# EasyEDA Pro project timer.eprj

# Schematic Schematic1

## Sheets
1 控制部分: Board Name: Board1; Create Date: 2025-01-11; Page Name: 控制部分; Project Name: timer; Schematic Name: Schematic1; Update Date: 2025-02-27; Company: 嘉立创EDA; Page Size: A4; Version: V1.0
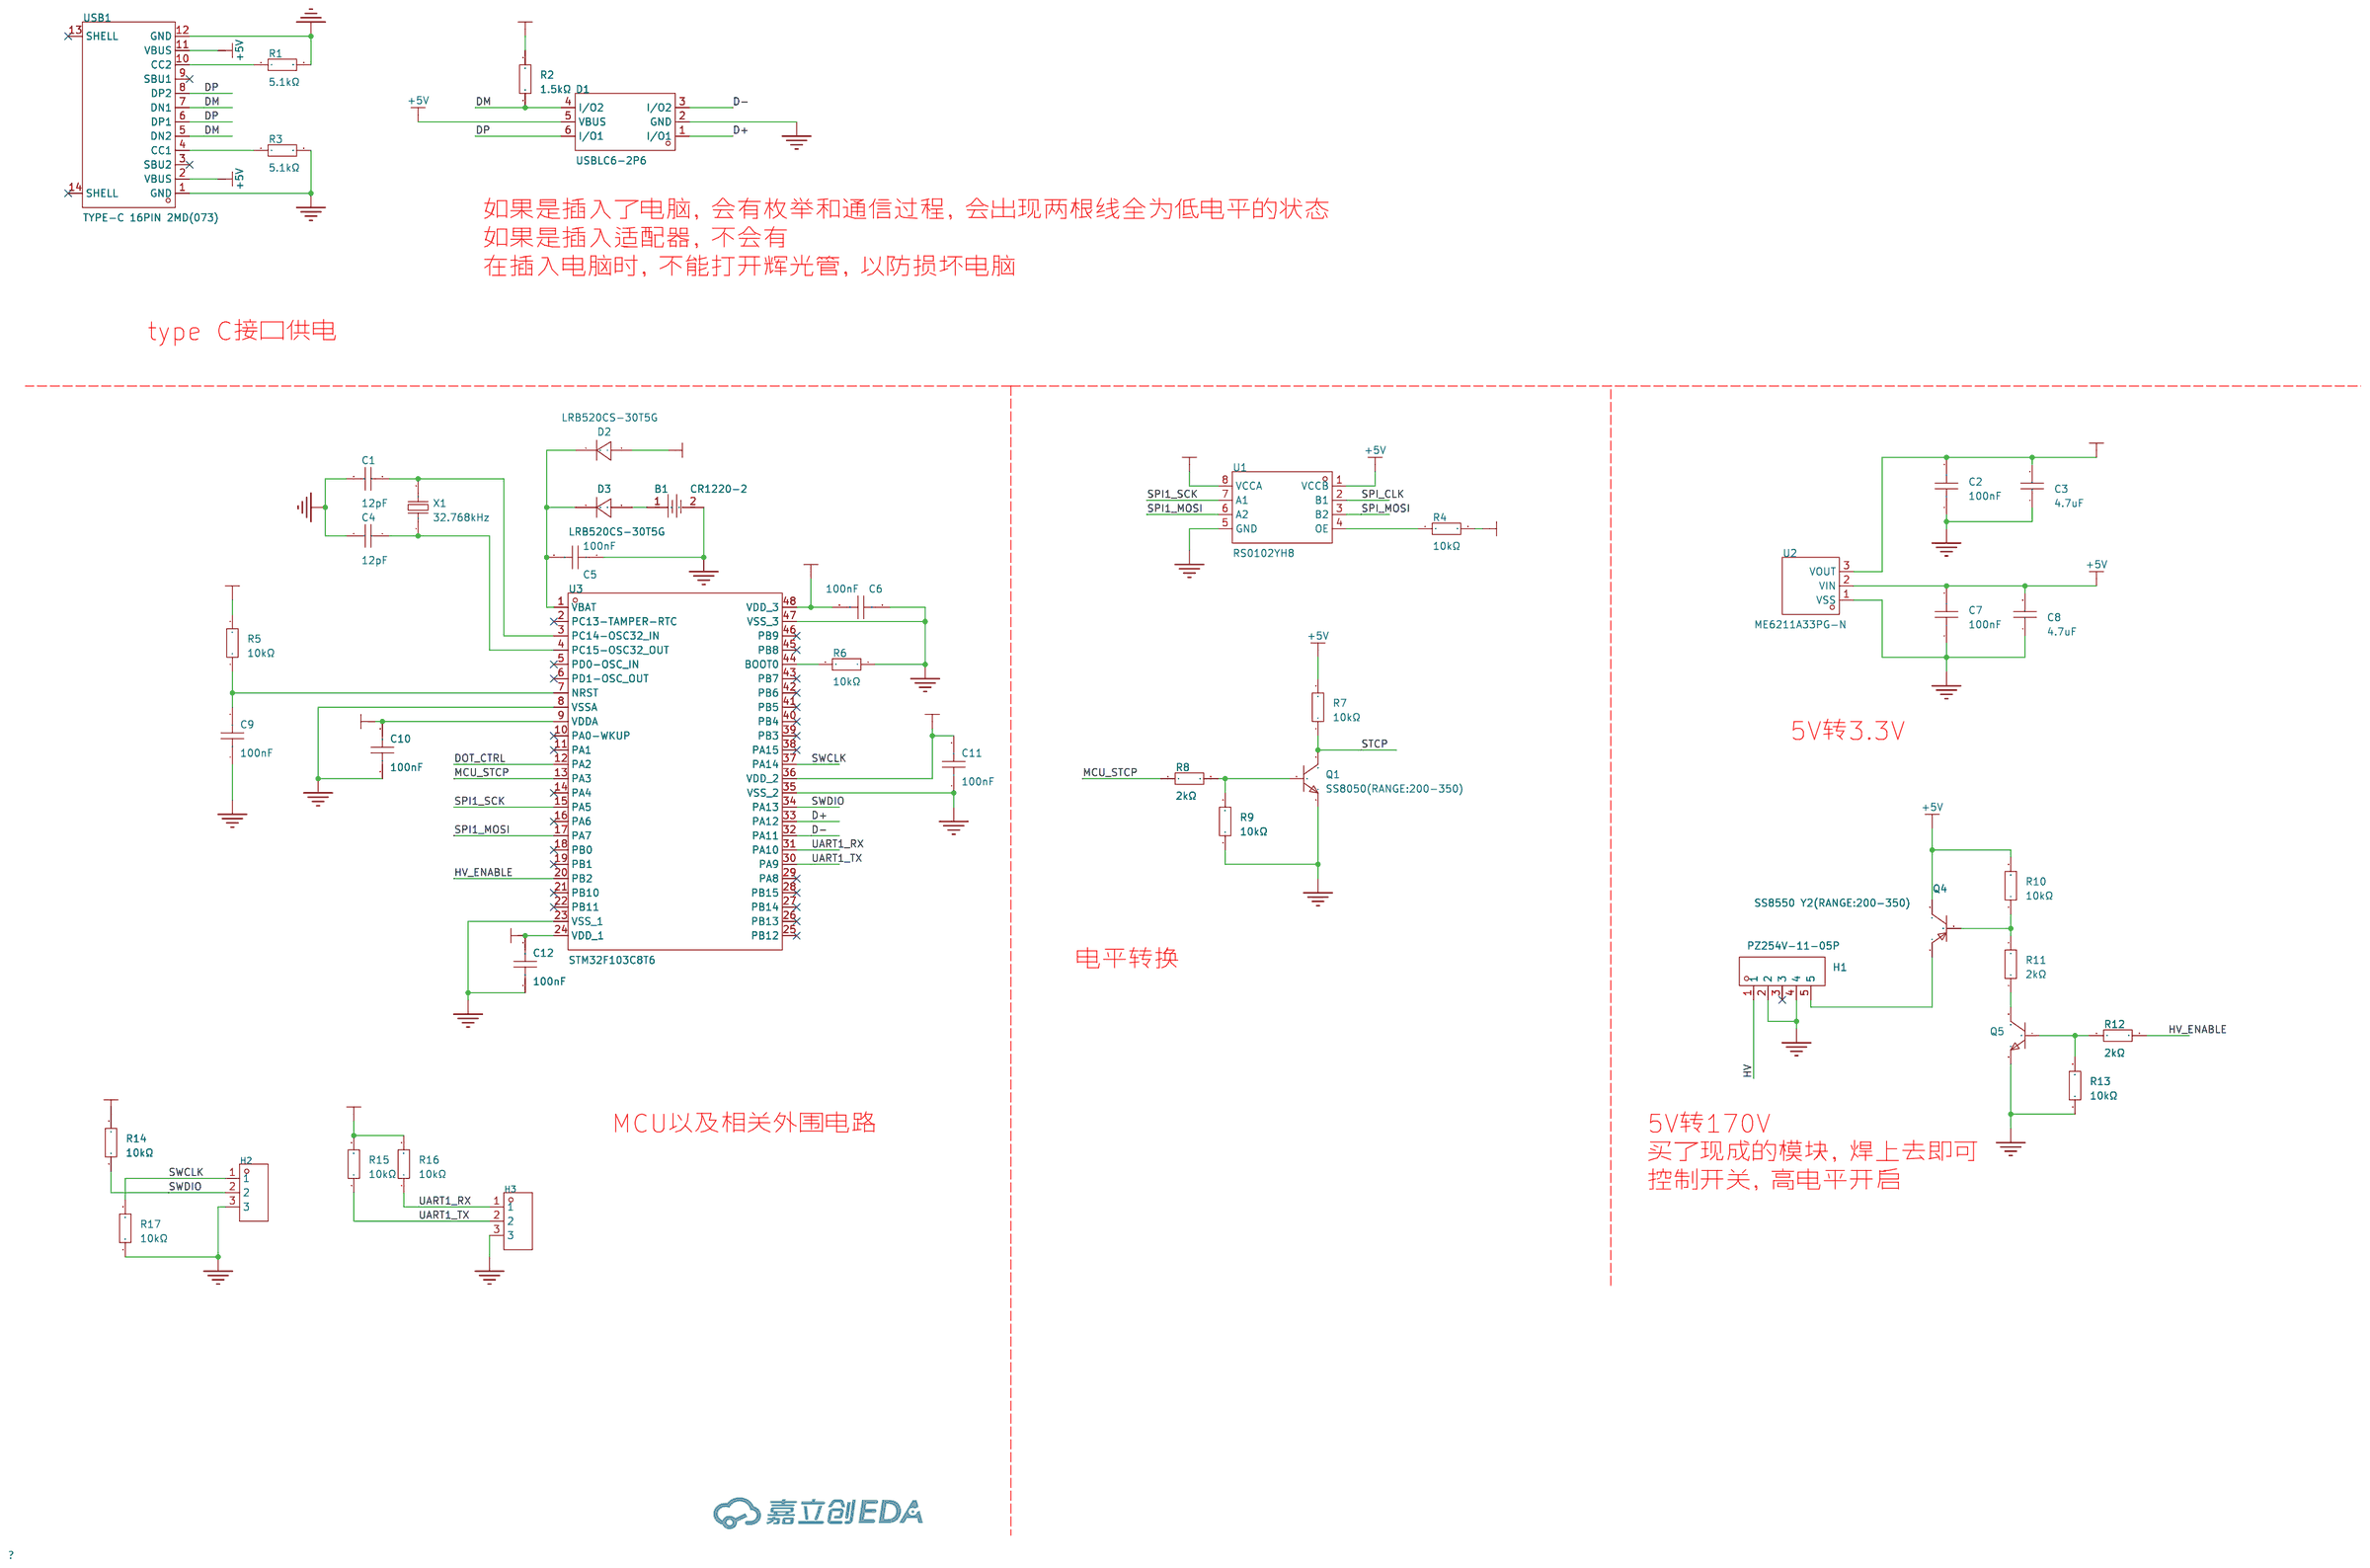
[diagram p0: 控制部分]
2 显示部分: Page Name: 显示部分; Update Date: 2025-01-16
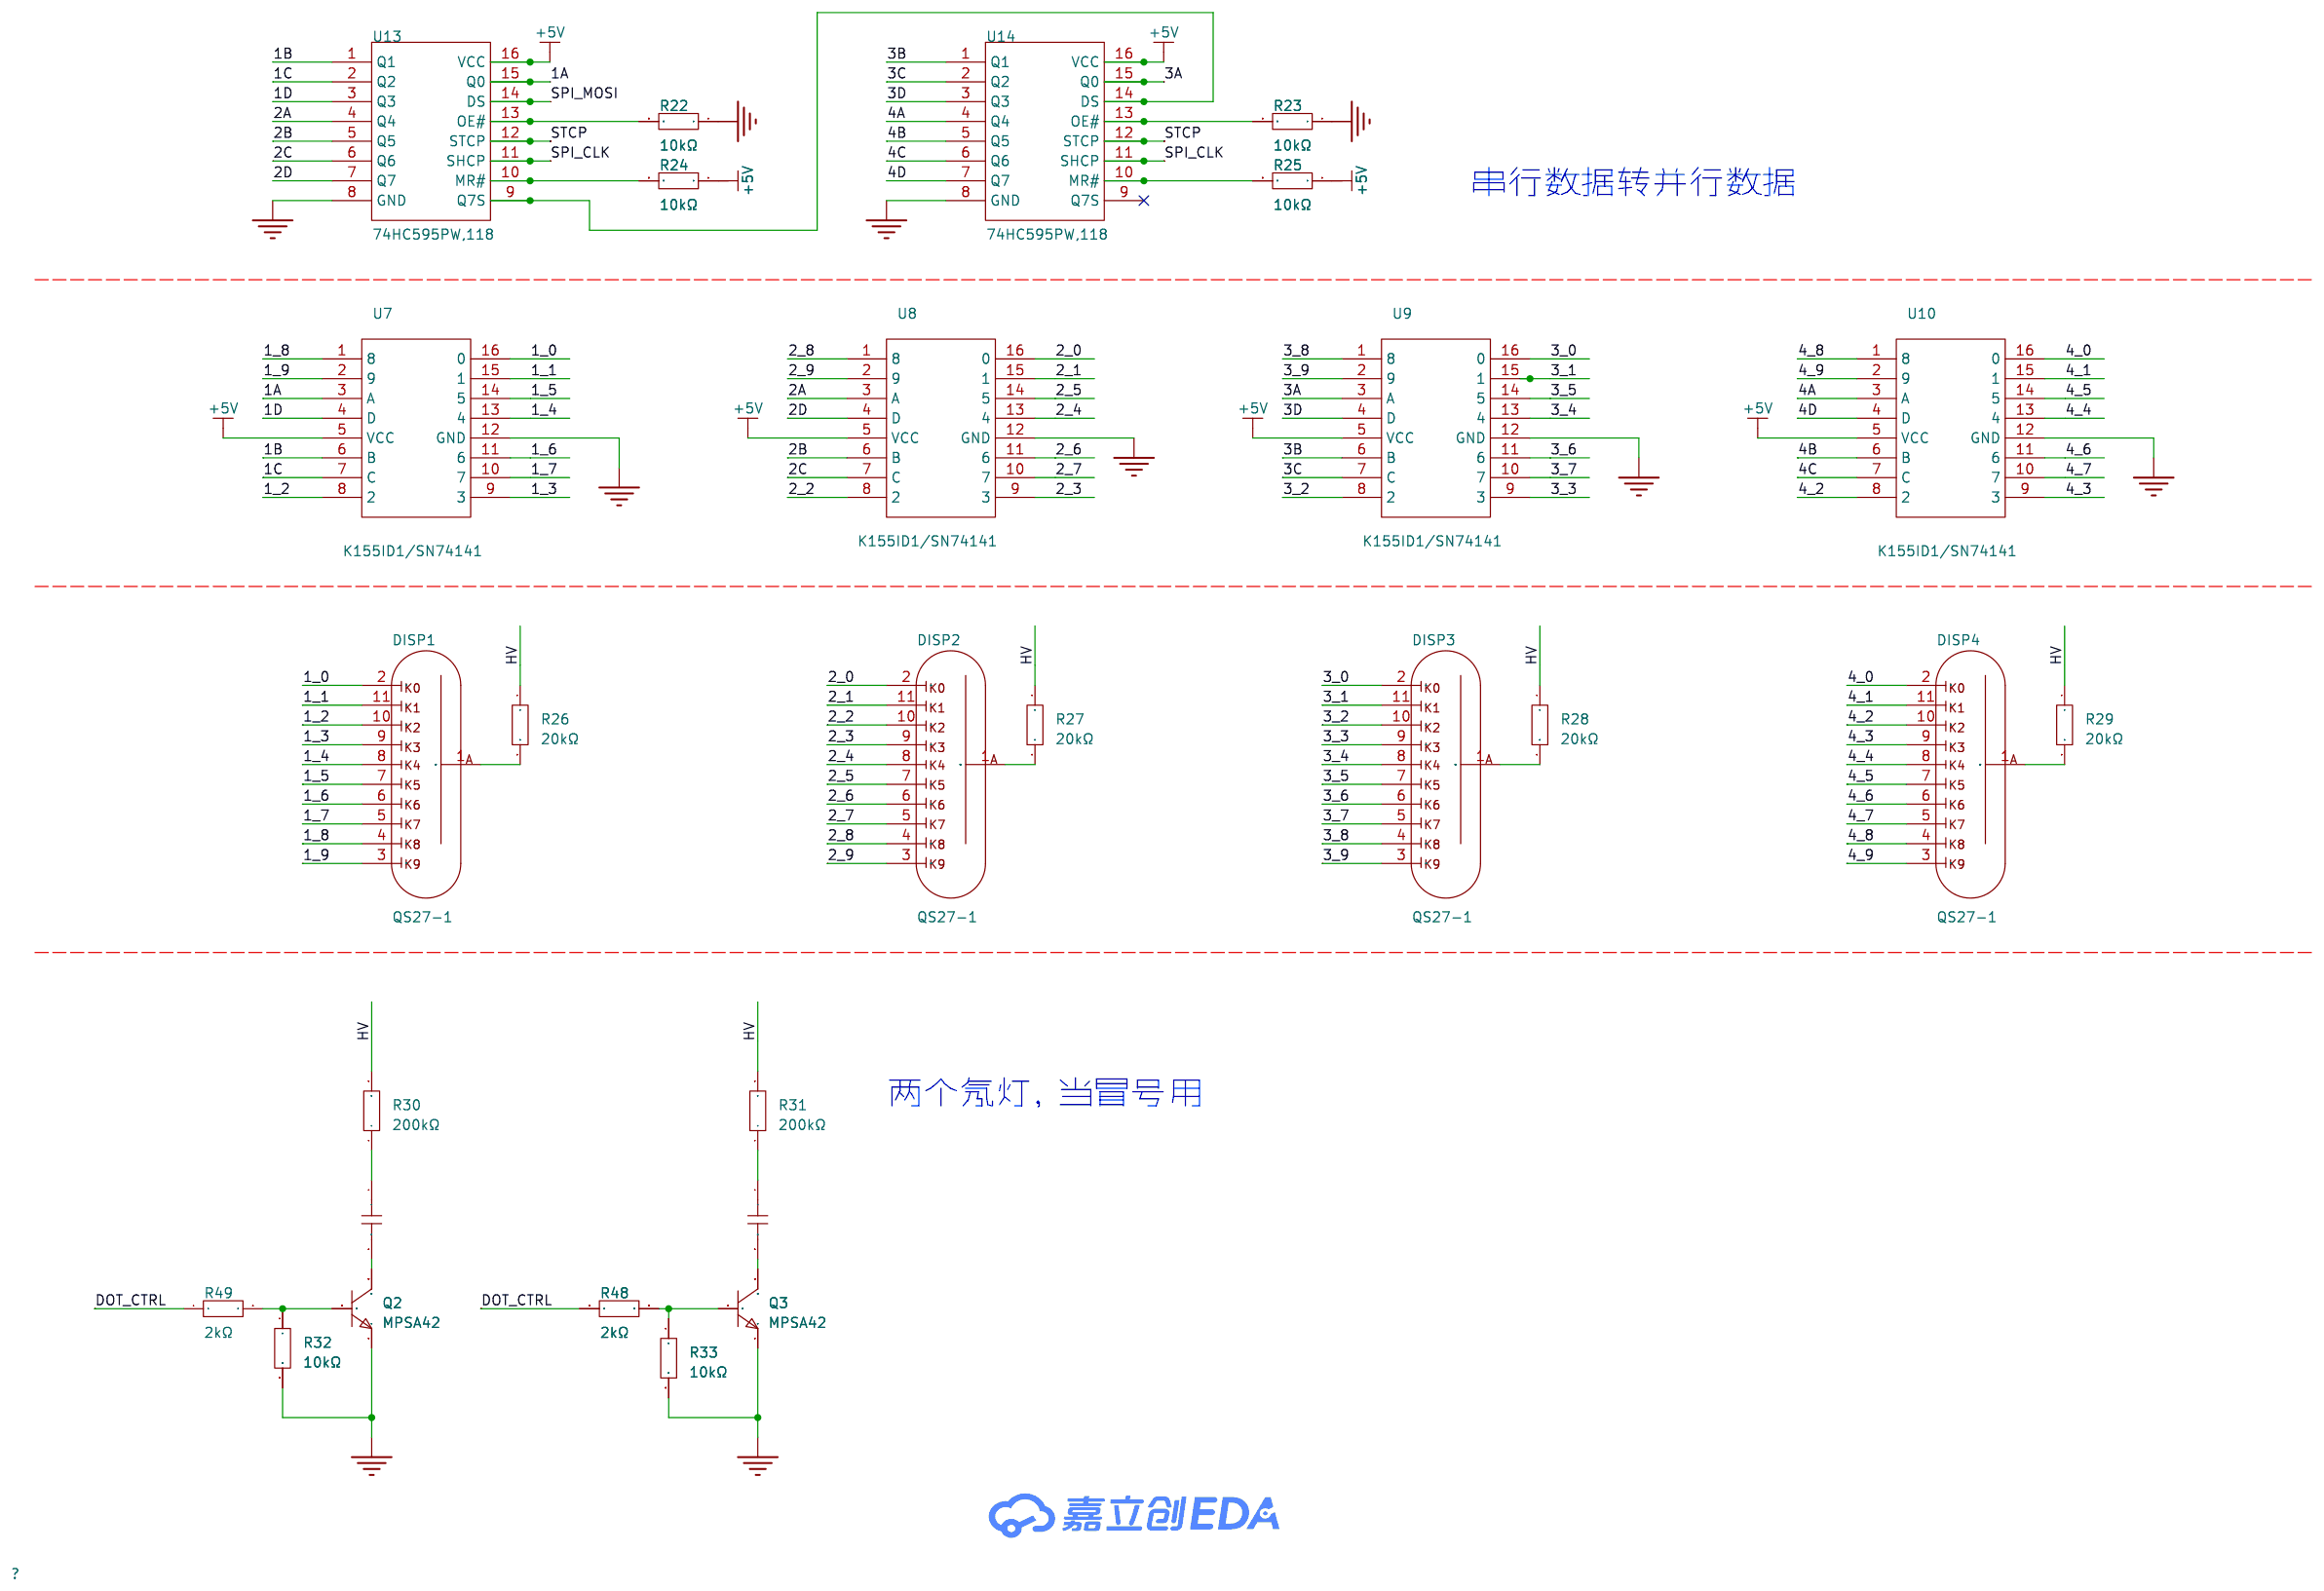
[diagram p1: 显示部分]

## Parts
sheet 控制部分
B1  CR1220-2  [BAT-SMD_CR1220-2]
C1  12pF  [C0603]
C2  100nF  [C0603]
C3  4.7uF  [C0603]
C4  12pF  [C0603]
C5  100nF  [C0603]
C6  100nF  [C0603]
C7  100nF  [C0603]
C8  4.7uF  [C0603]
C9  100nF  [C0603]
C10  100nF  [C0603]
C11  100nF  [C0603]
C12  100nF  [C0603]
D1  USBLC6-2P6  [SOT-666-6_L1.6-W1.2-P0.50-LS1.6-BL]
D2  LRB520CS-30T5G  [SOD-923_L0.8-W0.6-LS1.0-RD]
D3  LRB520CS-30T5G  [SOD-923_L0.8-W0.6-LS1.0-RD]
H1  PZ254V-11-05P  [HDR-TH_5P-P2.54-V-M]
H2  PZ254V-11-03P  [HDR-TH_3P-P2.54-V-M]
H3  PZ254V-11-03P  [HDR-TH_3P-P2.54-V-M]
Q1  SS8050(RANGE:200-350)  [SOT-23-3_L2.9-W1.3-P1.90-LS2.4-BR]
Q4  SS8550 Y2(RANGE:200-350)  [SOT-23-3_L2.9-W1.3-P1.90-LS2.4-BR]
Q5  SS8050(RANGE:200-350)  [SOT-23-3_L2.9-W1.3-P1.90-LS2.4-BR]
R1  5.1kΩ  [R0603]
R2  1.5kΩ  [R0603]
R3  5.1kΩ  [R0603]
R4  10kΩ  [R0603]
R5  10kΩ  [R0603]
R6  10kΩ  [R0603]
R7  10kΩ  [R0603]
R8  2kΩ  [R0603]
R9  10kΩ  [R0603]
R10  10kΩ  [R0603]
R11  2kΩ  [R0603]
R12  2kΩ  [R0603]
R13  10kΩ  [R0603]
R14  10kΩ  [R0603]
R15  10kΩ  [R0603]
R16  10kΩ  [R0603]
R17  10kΩ  [R0603]
U1  RS0102YH8  [SOT-23-8_L3.0-W1.7-P0.65-LS2.8-BL]
U2  ME6211A33PG-N  [SOT-89_L4.5-W2.5-P1.50-LS4.2-BR]
U3  STM32F103C8T6  [LQFP-48_L7.0-W7.0-P0.50-LS9.0-BL]
USB1  TYPE-C 16PIN 2MD(073)  [USB-C-SMD_TYPE-C-6PIN-2MD-073]
X1  32.768kHz  [FC-135R_L3.2-W1.5]
sheet 显示部分
DISP1  QS27-1  [QS27-1]
DISP2  QS27-1  [QS27-1]
DISP3  QS27-1  [QS27-1]
DISP4  QS27-1  [QS27-1]
NE1  NE  [NE]
NE2  NE  [NE]
Q2  MPSA42  [TO-92-3_L4.9-W3.7-P1.27-L]
Q3  MPSA42  [TO-92-3_L4.9-W3.7-P1.27-L]
R22  10kΩ  [R0603]
R23  10kΩ  [R0603]
R24  10kΩ  [R0603]
R25  10kΩ  [R0603]
R26  20kΩ  [R1206]
R27  20kΩ  [R1206]
R28  20kΩ  [R1206]
R29  20kΩ  [R1206]
R30  200kΩ  [R1206]
R31  200kΩ  [R1206]
R32  10kΩ  [R0603]
R33  10kΩ  [R0603]
R48  2kΩ  [R0603]
R49  2kΩ  [R0603]
U7  K155ID1/SN74141  [DIP16]
U8  K155ID1/SN74141  [DIP16]
U9  K155ID1/SN74141  [DIP16]
U10  K155ID1/SN74141  [DIP16]
U13  74HC595PW,118  [TSSOP-16_L5.0-W4.4-P0.65-LS6.4-BL]
U14  74HC595PW,118  [TSSOP-16_L5.0-W4.4-P0.65-LS6.4-BL]

## Library data of the parts
B1 = CR1220-2: LCSC Part Name: 电池底座 适用电池:CR1220; Supplier Part: C70381; Manufacturer: Q&J; Supplier Footprint: SMD; JLCPCB Part Class: 扩展库; Datasheet: https://atta.szlcsc.com/upload/public/pdf/source/20160427/1461725216696.pdf; Supplier: LCSC; Connector Type: 电池底座; Battery Type: CR1220
C1 C4 = CC0603JRNPO9BN120: LCSC Part Name: 12pF ±5% 50V; Supplier Part: C107034; Manufacturer: YAGEO(国巨); Supplier Footprint: 0603; JLCPCB Part Class: 扩展库; Datasheet: https://atta.szlcsc.com/upload/public/pdf/source/20170914/C128857_1505359892143968080.pdf; Supplier: LCSC; Tolerance: ±5%; Voltage Rated: 50V; Temperature Coefficient: NP0
C2 C5-C7 C9-C12 = CC0603KRX7R9BB104: LCSC Part Name: 100nF ±10% 50V; Supplier Part: C14663; Manufacturer: YAGEO(国巨); Supplier Footprint: 0603; JLCPCB Part Class: 基础库; Datasheet: https://atta.szlcsc.com/upload/public/pdf/source/20180910/C282072_33301C7F631E79921B82A8DAC6BCC5B3.pdf; Supplier: LCSC; Tolerance: ±10%; Voltage Rated: 50V; Temperature Coefficient: X7R
C3 C8 = CL10A475KO8NNNC: LCSC Part Name: 4.7uF ±10% 16V; Supplier Part: C19666; Manufacturer: SAMSUNG(三星); Supplier Footprint: 0603; JLCPCB Part Class: 基础库; Datasheet: https://atta.szlcsc.com/upload/public/pdf/source/20160218/1457707763339.pdf; Supplier: LCSC; Tolerance: ±10%; Voltage Rated: 16V; Temperature Coefficient: X5R
D1 = USBLC6-2P6_C2827693: LCSC Part Name: MSL=3; Supplier Part: C2827693; Manufacturer: TECH PUBLIC(台舟); Supplier Footprint: SOT-666-6; JLCPCB Part Class: 扩展库; Datasheet: https://atta.szlcsc.com/upload/public/pdf/source/20210810/36353A9194EA9F4E33F8AE18BE051AEA.pdf; Supplier: LCSC; polarity: 单向; Reverse Stand-Off Voltage (Vrwm): 5V; Maximum Clamping Voltage: 14V; Peak Pulse Current (Ipp): 5.5A; Peak Pulse Power Dissipation (Ppp): 80W; Breakdown Voltage: 6V; Reverse Leakage Current (Ir): 80nA; Number of Lines: 双路; Operating Temperature: -55℃~+125℃; level of protection: IEC 61000-4-2; Type: ESD
D2 D3 = LRB520CS-30T5G: LCSC Part Name: 电压:30V 电流:100mA; Supplier Part: C131732; Manufacturer: LRC(乐山无线电); Supplier Footprint: SOD-923; JLCPCB Part Class: 扩展库; Datasheet: https://atta.szlcsc.com/upload/public/pdf/source/20180130/C131732_15172972951101323323.pdf; Supplier: LCSC; Forward Voltage (Vf@If): 450mV; Reverse Voltage (Vr): 30V; Rectified Current: 100mA; Reverse Leakage Current (Ir): 500nA
H1 = PZ254V-11-05P: LCSC Part Name: 间距:2.54mm 1x5P 直插 方针; Supplier Part: C492404; Manufacturer: XFCN(兴飞); Supplier Footprint: 插件,P=2.54mm; JLCPCB Part Class: 扩展库; Datasheet: https://atta.szlcsc.com/upload/public/pdf/source/20200309/C492404_E51533260F8710EFF5D4617281164C1D.pdf; Supplier: LCSC; Pin Structure: 1x5P; Pitch: 2.54mm; Circluar Pins/Square Pins: 方针; Mounting Type: 直插; Number of Rows: 单排; Number of Pins: 5P; Length of Mating Pin: 6mm; Insulation Height: 2.5mm; Length of End Connection Pin: 3mm; Contact Material: 黄铜; Operating Temperature Range: -40℃~+105℃; Color: 黑色
H2 H3 = PZ254V-11-03P: 插针结构:1x3P;间距:2.54mm;行距:-;圆针/方针:方针;安装类型:直插;排数:单排;总PIN位数:3P;额定电流:3A;额定电压:250V;配合针长度:6mm;塑高:2.5mm;端接针长度:3mm;工作温度范围:-40℃~+105℃;颜色:黑色;; LCSC Part Name: 间距:2.54mm 1x3P 直插 方针; Supplier Part: C2937625; Manufacturer: XFCN(兴飞); Supplier Footprint: 插件,P=2.54mm; JLCPCB Part Class: 扩展库; Datasheet: https://atta.szlcsc.com/upload/public/pdf/source/20200309/C492402_8335C3D49C4E4C618838D59BB1D024C1.pdf; Supplier: LCSC; Pin Structure: 1x3P; Pitch: 2.54mm; Circluar Pins/Square Pins: 方针; Mounting Type: 直插; Number of Rows: 单排; Number of Pins: 3P; Current Rating (Max): 3A; Voltage Rating (Max): 250V; Length of Mating Pin: 6mm; Insulation Height: 2.5mm; Length of End Connection Pin: 3mm; Operating Temperature Range: -40℃~+105℃; Color: 黑色
Q1 Q5 = SS8050(RANGE:200-350)_C2150: LCSC Part Name: NPN 电流:1.5A 耐压:25V hfe=200~350; Supplier Part: C2150; Manufacturer: CJ(江苏长电/长晶); Supplier Footprint: SOT-23; JLCPCB Part Class: 基础库; Datasheet: https://atta.szlcsc.com/upload/public/pdf/source/20230322/AEE86F4B043774EFF80CAEA14A37D9E9.pdf; Supplier: LCSC; Transistor Type: NPN; Collector Current (Ic): 1.5A; Collector-Emitter Breakdown Voltage (Vceo): 25V; Power Dissipation (Pd): 300mW; DC Current Gain (hFE@Ic,Vce): 200@800mA,1V; Transition Frequency (fT): 100MHz; Collector Cut-Off Current (Icbo): 100nA; Collector-Emitter Saturation Voltage (VCE(sat)@Ic,Ib): 500mV@800mA,80mA; Operating Temperature: -55℃~+150℃
Q4 = SS8550 Y2(RANGE:200-350): LCSC Part Name: PNP 电流:1.5A 耐压:25V hfe=200~350; Supplier Part: C8542; Manufacturer: CJ(江苏长电/长晶); Supplier Footprint: SOT-23; JLCPCB Part Class: 基础库; Datasheet: https://atta.szlcsc.com/upload/public/pdf/source/20140809/1457707214734.pdf; Supplier: LCSC; Transistor Type: PNP; Collector Current (Ic): 1.5A; Collector-Emitter Breakdown Voltage (Vceo): 25V; Power Dissipation (Pd): 300mW; DC Current Gain (hFE@Ic,Vce): 200@100mA,1V; Transition Frequency (fT): 100MHz; Collector Cut-Off Current (Icbo): 100nA; Collector-Emitter Saturation Voltage (VCE(sat)@Ic,Ib): 500mV@800mA,80mA; Operating Temperature: -55℃~+150℃
R1 R3 = 0603WAF5101T5E: LCSC Part Name: 5.1kΩ ±1% 100mW 厚膜电阻; Supplier Part: C23186; Manufacturer: UNI-ROYAL(厚声); Supplier Footprint: 0603; JLCPCB Part Class: 基础库; Datasheet: https://atta.szlcsc.com/upload/public/pdf/source/20200306/C422600_1E6D84923E4A46A82E41ADD87F860B5C.pdf; Supplier: LCSC; Type: 厚膜电阻; Tolerance: ±1%; Power(Watts): 100mW; Overload Voltage (Max): 75V; Temperature Coefficient: ±100ppm/℃; Operating Temperature Range: -55℃~+155℃
R2 = 0603WAF1501T5E: LCSC Part Name: 1.5kΩ ±1% 100mW 厚膜电阻; Supplier Part: C22843; Manufacturer: UNI-ROYAL(厚声); Supplier Footprint: 0603; JLCPCB Part Class: 基础库; Datasheet: https://atta.szlcsc.com/upload/public/pdf/source/20200306/C422600_1E6D84923E4A46A82E41ADD87F860B5C.pdf; Supplier: LCSC; Type: 厚膜电阻; Tolerance: ±1%; Power(Watts): 100mW; Overload Voltage (Max): 75V; Temperature Coefficient: ±100ppm/℃; Operating Temperature Range: -55℃~+155℃
R4-R7 R9 R10 R13-R17 R22-R25 R32 R33 = 0603WAF1002T5E: LCSC Part Name: 厚膜电阻 10kΩ ±1% 100mW; Supplier Part: C25804; Manufacturer: UNI-ROYAL(厚声); Supplier Footprint: 0603; JLCPCB Part Class: 基础库; Datasheet: https://atta.szlcsc.com/upload/public/pdf/source/20200306/C422600_1E6D84923E4A46A82E41ADD87F860B5C.pdf; Supplier: LCSC; Type: 厚膜电阻; Tolerance: ±1%; Power(Watts): 100mW; Overload Voltage (Max): 75V; Temperature Coefficient: ±100ppm/℃; Operating Temperature Range: -55℃~+155℃
R8 R11 R12 R48 R49 = 0603WAF2001T5E: LCSC Part Name: 2kΩ ±1% 100mW 厚膜电阻; Supplier Part: C22975; Manufacturer: UNI-ROYAL(厚声); Supplier Footprint: 0603; JLCPCB Part Class: 基础库; Datasheet: https://atta.szlcsc.com/upload/public/pdf/source/20200306/C422600_1E6D84923E4A46A82E41ADD87F860B5C.pdf; Supplier: LCSC; Type: 厚膜电阻; Tolerance: ±1%; Power(Watts): 100mW; Overload Voltage (Max): 75V; Temperature Coefficient: ±100ppm/℃; Operating Temperature Range: -55℃~+155℃
U1 = RS0102YH8: LCSC Part Name: 电平转换芯片; Supplier Part: C783414; Manufacturer: RUNIC(润石); Supplier Footprint: SOT-23-8; JLCPCB Part Class: 扩展库; Datasheet: https://atta.szlcsc.com/upload/public/pdf/source/20200914/C783414_6557205211B20B027C7967DA27FC02D7.pdf; Supplier: LCSC; Channel Type: 双向; Data Rate: 24Mbps; Supply Voltage (VCCA): 1.65V~5.5V; Supply Voltage (VCCB): 2.3V~5.5V; Number of Circuits: 1; Channels per Circuit: 2; Output Type: 推挽式；开路漏极; Operating Temperature: -40℃~+85℃
U2 = ME6211A33PG-N: LCSC Part Name: 输入6V 输出3.3V 500mA; Supplier Part: C236673; Manufacturer: MICRONE(南京微盟); Supplier Footprint: SOT-89; JLCPCB Part Class: 扩展库; Datasheet: https://atta.szlcsc.com/upload/public/pdf/source/20180801/C94042_8FDAFF138ADDED65E3D077205E9A8C17.pdf; Supplier: LCSC; Output Type: 固定; Maximum Input Voltage: 6V; Output Voltage: 3.3V; MAX Output Current: 500mA; Power Supply Rejection Ratio (PSRR): 70dB; Dropout Voltage: 260mV@(200mA); Output Polarity: 正极; Number of Outputs: 1
U3 = STM32F103C8T6: LCSC Part Name: 主流增强型ARM Cortex-M3 MCU，具有64 KB Flash、72 MHz CPU、电机控制、USB和CAN; Supplier Part: C8734; Manufacturer: ST(意法半导体); Supplier Footprint: LQFP-48(7x7); JLCPCB Part Class: 扩展库; Datasheet: https://atta.szlcsc.com/upload/public/pdf/source/20220812/8363ACEC51AD55ECEB84799464F7CB85.pdf; Supplier: LCSC; CPU Core: ARM-M3; CPU Maximum Speed: 72MHz; Program Storage Size: 64KB; Program Memory Type: FLASH; Number of I/O: 37; ADC (Bit): 12bit; Low Voltage Detection Threshold: 2V~3.6V
USB1 = TYPE-C 16PIN 2MD(073): LCSC Part Name: Type-C 母 卧贴; Supplier Part: C2765186; Manufacturer: SHOU HAN(首韩); Supplier Footprint: SMD; JLCPCB Part Class: 扩展库; Datasheet: https://atta.szlcsc.com/upload/public/pdf/source/20211123/39B17C16241EAC15C5E277BDA434118E.pdf; Supplier: LCSC; Connector Type: Type-C; Standard: USB 3.1; Gender: 母; Mounting Style: 卧贴; Number of Contacts: 16P; Number of Ports: 1; Current Rating - Power (Max): 5A; Operating Temperature Range: -25℃~+85℃; Rated Voltage (Max): 5V; Connect-Disconnect Life: 5千次; Core Colour: 黑色
X1 = Q13FC13500004_C32346: LCSC Part Name: 32.768kHz ±20ppm 12.5pF; Supplier Part: C32346; Manufacturer: EPSON(爱普生); Manufacturer Part: Q13FC13500004; Supplier Footprint: SMD3215-2P; JLCPCB Part Class: 基础库; Datasheet: https://atta.szlcsc.com/upload/public/pdf/source/20240418/0E0FF5F0356BA3753F616001439D1416.pdf; Supplier: LCSC; Crystal Type: 贴片晶振; Normal temperature Frequency Tolerance: ±20ppm; Load Capacitor: 12.5pF; Equivalent Series Resistance (ESR): 70kΩ; Operating Temperature: -40℃~+85℃
DISP1-DISP4 = QS27-1
NE1 NE2 = NE
Q2 Q3 = MPSA42: LCSC Part Name: NPN 电流:200mA 耐压:305V; Supplier Part: C2991971; Manufacturer: CJ(江苏长电/长晶); Supplier Footprint: TO-92-3; JLCPCB Part Class: 扩展库; Datasheet: https://atta.szlcsc.com/upload/public/pdf/source/20220411/60EF6285A7B3440D35B218BF34EED706.pdf; Supplier: LCSC; Transistor Type: NPN; Collector Current (Ic): 200mA; Collector-Emitter Breakdown Voltage (Vceo): 305V; Power Dissipation (Pd): 625mW; DC Current Gain (hFE@Ic,Vce): 60@1mA,10V; Transition Frequency (fT): 50MHz; Collector Cut-Off Current (Icbo): 250nA; Collector-Emitter Saturation Voltage (VCE(sat)@Ic,Ib): 200mV@20mA,2mA; Operating Temperature: -55℃~+150℃
R26-R29 = 1206W4J0203T5E: LCSC Part Name: 20kΩ ±5% 250mW 厚膜电阻; Supplier Part: C25652; Manufacturer: UNI-ROYAL(厚声); Supplier Footprint: 1206; JLCPCB Part Class: 扩展库; Datasheet: https://atta.szlcsc.com/upload/public/pdf/source/20200306/C422600_1E6D84923E4A46A82E41ADD87F860B5C.pdf; Supplier: LCSC; Type: 厚膜电阻; Tolerance: ±5%; Power(Watts): 250mW; Overload Voltage (Max): 200V; Temperature Coefficient: ±100ppm/℃; Operating Temperature Range: -55℃~+155℃
R30 R31 = RC1206FR-07200KL: LCSC Part Name: 厚膜电阻 200kΩ ±1% 250mW; Supplier Part: C114937; Manufacturer: YAGEO(国巨); Supplier Footprint: 1206; JLCPCB Part Class: 扩展库; Datasheet: https://atta.szlcsc.com/upload/public/pdf/source/20180821/C275644_0D56F95EFF785E7D9A1FEF436B37DA78.pdf; Supplier: LCSC; Type: 厚膜电阻; Tolerance: ±1%; Power(Watts): 250mW; Overload Voltage (Max): 200V; Temperature Coefficient: ±100ppm/℃; Operating Temperature Range: -55℃~+155℃
U7-U10 = K155ID1/SN74141
U13 U14 = 74HC595PW,118: LCSC Part Name: 三态输出 串行至串行或并行移位寄存器; Supplier Part: C5948; Manufacturer: Nexperia(安世); Supplier Footprint: TSSOP-16; JLCPCB Part Class: 扩展库; Datasheet: https://atta.szlcsc.com/upload/public/pdf/source/20240724/C3A3241CA190230F407C83CEC4244600.pdf; Supplier: LCSC; Function: 串行至串行或并行; Supply Voltage: 2V~6V; Number of Elements: 1; Number of Bits per Element: 8; Output Type: 三态; Series: 74HC; Operating Temperature: -40℃~+125℃

## Nets
3.3V: C2.2 C3.2 C6.2 C10.2 C11.2 C12.2 D2.2(A) R2.1 R4.2 R5.2 R14.2 R15.2 R16.2 U1.8(VCCA) U2.3(VOUT) U3.9(VDDA) U3.24(VDD_1) U3.36(VDD_2) U3.48(VDD_3)
+5V: C7.2 C8.2 D1.5(VBUS) Q4.3(C) R7.2 R10.2 R24.1 R25.1 U1.1(VCCB) U2.2(VIN) U7.5(VCC) U8.5(VCC) U9.5(VCC) U10.5(VCC) U13.16(VCC) U14.16(VCC) USB1.2(VBUS) USB1.11(VBUS)
GND: B1.2 C1.2 C2.1 C3.1 C4.2 C5.1 C6.1 C7.1 C8.1 C9.1 C10.1 C11.1 C12.1 D1.2(GND) H1.2 H1.4 H2.3 H3.3 Q1.2(E) Q2.1(E) Q3.1(E) Q5.2(E) R1.2 R3.2 R6.1 R9.1 R13.1 R17.1 R22.1 R23.1 R32.2 R33.2 U1.5(GND) U2.1(VSS) U3.8(VSSA) U3.23(VSS_1) U3.35(VSS_2) U3.47(VSS_3) U7.12(GND) U8.12(GND) U9.12(GND) U10.12(GND) U13.8(GND) U14.8(GND) USB1.1(GND) USB1.12(GND)
1_0: DISP1.2(K0) U7.16(0)
1_1: DISP1.11(K1) U7.15(1)
1_2: DISP1.10(K2) U7.8(2)
1_3: DISP1.9(K3) U7.9(3)
1_4: DISP1.8(K4) U7.13(4)
1_5: DISP1.7(K5) U7.14(5)
1_6: DISP1.6(K6) U7.11(6)
1_7: DISP1.5(K7) U7.10(7)
1_8: DISP1.4(K8) U7.1(8)
1_9: DISP1.3(K9) U7.2(9)
1A: U7.3(A) U13.15(Q0)
1B: U7.6(B) U13.1(Q1)
1C: U7.7(C) U13.2(Q2)
1D: U7.4(D) U13.3(Q3)
2_0: DISP2.2(K0) U8.16(0)
2_1: DISP2.11(K1) U8.15(1)
2_2: DISP2.10(K2) U8.8(2)
2_3: DISP2.9(K3) U8.9(3)
2_4: DISP2.8(K4) U8.13(4)
2_5: DISP2.7(K5) U8.14(5)
2_6: DISP2.6(K6) U8.11(6)
2_7: DISP2.5(K7) U8.10(7)
2_8: DISP2.4(K8) U8.1(8)
2_9: DISP2.3(K9) U8.2(9)
2A: U8.3(A) U13.4(Q4)
2B: U8.6(B) U13.5(Q5)
2C: U8.7(C) U13.6(Q6)
2D: U8.4(D) U13.7(Q7)
3_0: DISP3.2(K0) U9.16(0)
3_1: DISP3.11(K1) U9.15(1)
3_2: DISP3.10(K2) U9.8(2)
3_3: DISP3.9(K3) U9.9(3)
3_4: DISP3.8(K4) U9.13(4)
3_5: DISP3.7(K5) U9.14(5)
3_6: DISP3.6(K6) U9.11(6)
3_7: DISP3.5(K7) U9.10(7)
3_8: DISP3.4(K8) U9.1(8)
3_9: DISP3.3(K9) U9.2(9)
3A: U9.3(A) U14.15(Q0)
3B: U9.6(B) U14.1(Q1)
3C: U9.7(C) U14.2(Q2)
3D: U9.4(D) U14.3(Q3)
4_0: DISP4.2(K0) U10.16(0)
4_1: DISP4.11(K1) U10.15(1)
4_2: DISP4.10(K2) U10.8(2)
4_3: DISP4.9(K3) U10.9(3)
4_4: DISP4.8(K4) U10.13(4)
4_5: DISP4.7(K5) U10.14(5)
4_6: DISP4.6(K6) U10.11(6)
4_7: DISP4.5(K7) U10.10(7)
4_8: DISP4.4(K8) U10.1(8)
4_9: DISP4.3(K9) U10.2(9)
4A: U10.3(A) U14.4(Q4)
4B: U10.6(B) U14.5(Q5)
4C: U10.7(C) U14.6(Q6)
4D: U10.4(D) U14.7(Q7)
D+: D1.1(I/O1) U3.33(PA12)
D-: D1.3(I/O2) U3.32(PA11)
DM: D1.4(I/O2) R2.2 USB1.5(DN2) USB1.7(DN1)
DOT_CTRL: R48.1 R49.1 U3.12(PA2)
DP: D1.6(I/O1) USB1.6(DP1) USB1.8(DP2)
HV: H1.1 R26.1 R27.1 R28.1 R29.1 R30.2 R31.2
HV_ENABLE: R12.2 U3.20(PB2)
MCU_STCP: R8.1 U3.13(PA3)
SPI1_MOSI: U1.6(A2) U3.17(PA7)
SPI1_SCK: U1.7(A1) U3.15(PA5)
SPI_CLK: U1.2(B1) U13.11(SHCP) U14.11(SHCP)
SPI_MOSI: U1.3(B2) U13.14(DS)
STCP: Q1.3(C) R7.1 U13.12(STCP) U14.12(STCP)
SWCLK: H2.1 R17.2 U3.37(PA14)
SWDIO: H2.2 R14.1 U3.34(PA13)
UART1_RX: H3.1 R16.1 U3.31(PA10)
UART1_TX: H3.2 R15.1 U3.30(PA9)
$1N3910: C1.1 U3.3(PC14-OSC32_IN) X1.2
$1N3961: C4.1 U3.4(PC15-OSC32_OUT) X1.1
$1N4256: C5.2 D2.1(C) D3.1(C) U3.1(VBAT)
$1N4428: C9.2 R5.1 U3.7(NRST)
$1N5489: R1.1 USB1.10(CC2)
$1N5494: R3.1 USB1.4(CC1)
$1N5575: R6.2 U3.44(BOOT0)
$1N9036: H1.5 Q4.2(E)
$1N14895: B1.1 D3.2(A)
$1N27037: R4.1 U1.4(OE)
$1N27425: Q1.1(B) R8.2 R9.2
$1N29272: Q4.1(B) R10.1 R11.2
$1N29379: Q5.1(B) R12.1 R13.2
$1N29410: Q5.3(C) R11.1
$2N1006: U13.9(Q7S) U14.14(DS)
$2N1078: R22.2 U13.13(OE#)
$2N1080: R23.2 U14.13(OE#)
$2N1103: R24.2 U13.10(MR#)
$2N1107: R25.2 U14.10(MR#)
$2N2676: DISP1.1(ANODE) R26.2
$2N2765: DISP2.1(ANODE) R27.2
$2N2853: DISP3.1(ANODE) R28.2
$2N2941: DISP4.1(ANODE) R29.2
$2N5464: NE1.2 Q2.3(C)
$2N5488: NE1.1 R30.1
$2N5622: NE2.2 Q3.3(C)
$2N5624: NE2.1 R31.1
$2N5723: Q3.2(B) R33.1 R48.2
$2N5739: Q2.2(B) R32.1 R49.2

Not connected (* = marked no-connect by the designer): H1 3*; U3 2(PC13-TAMPER-RTC)* 5(PD0-OSC_IN)* 6(PD1-OSC_OUT)* 10(PA0-WKUP)* 11(PA1)* 14(PA4)* 16(PA6)* 18(PB0)* 19(PB1)* 21(PB10)* 22(PB11)* 25(PB12)* 26(PB13)* 27(PB14)* 28(PB15)* 29(PA8)* 38(PA15)* 39(PB3)* 40(PB4)* 41(PB5)* 42(PB6)* 43(PB7)* 45(PB8)* 46(PB9)*; U14 9(Q7S)*; USB1 3(SBU2)* 9(SBU1)* 13(SHELL)* 14(SHELL)*

## Notes on the sheets
sheet 1
- 如果是插入了电脑，会有枚举和通信过程，会出现两根线全为低电平的状态
  如果是插入适配器，不会有
  在插入电脑时，不能打开辉光管，以防损坏电脑
- type C接口供电
- 5V转3.3V
- 电平转换
- MCU以及相关外围电路
- 5V转170V
  买了现成的模块，焊上去即可
  控制开关，高电平开启
sheet 2
- 串行数据转并行数据
- 两个氖灯，当冒号用

# Board PCB1
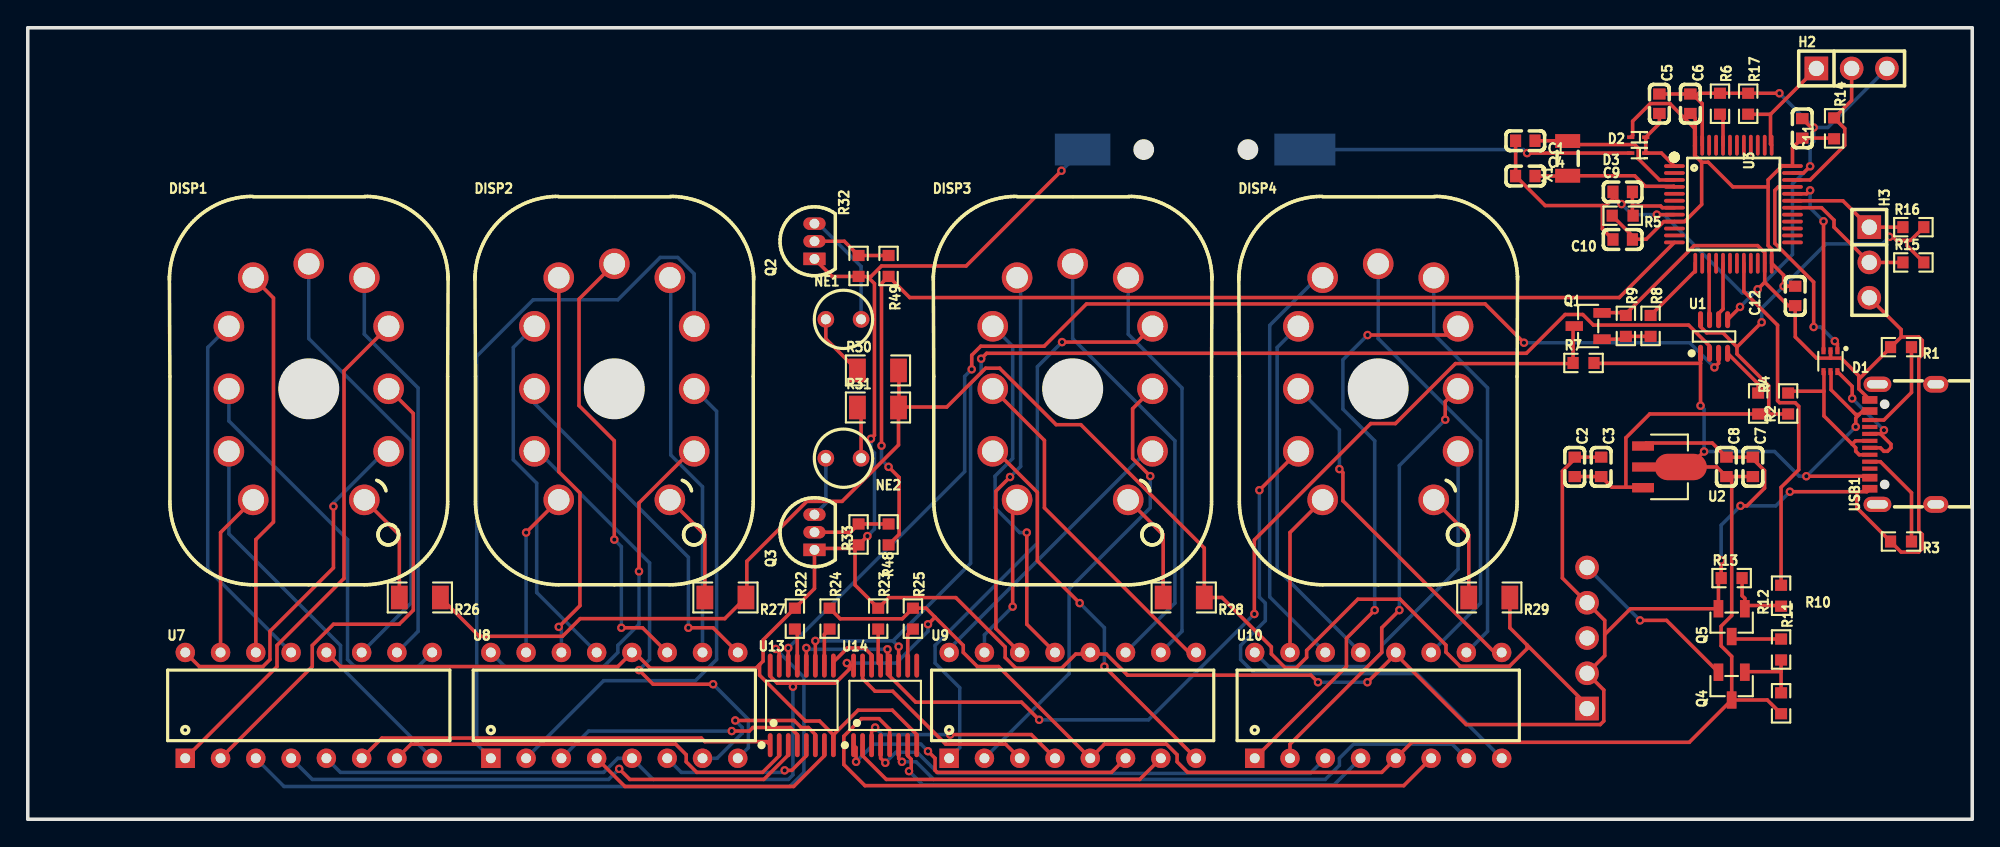
[diagram p2: board, top side]
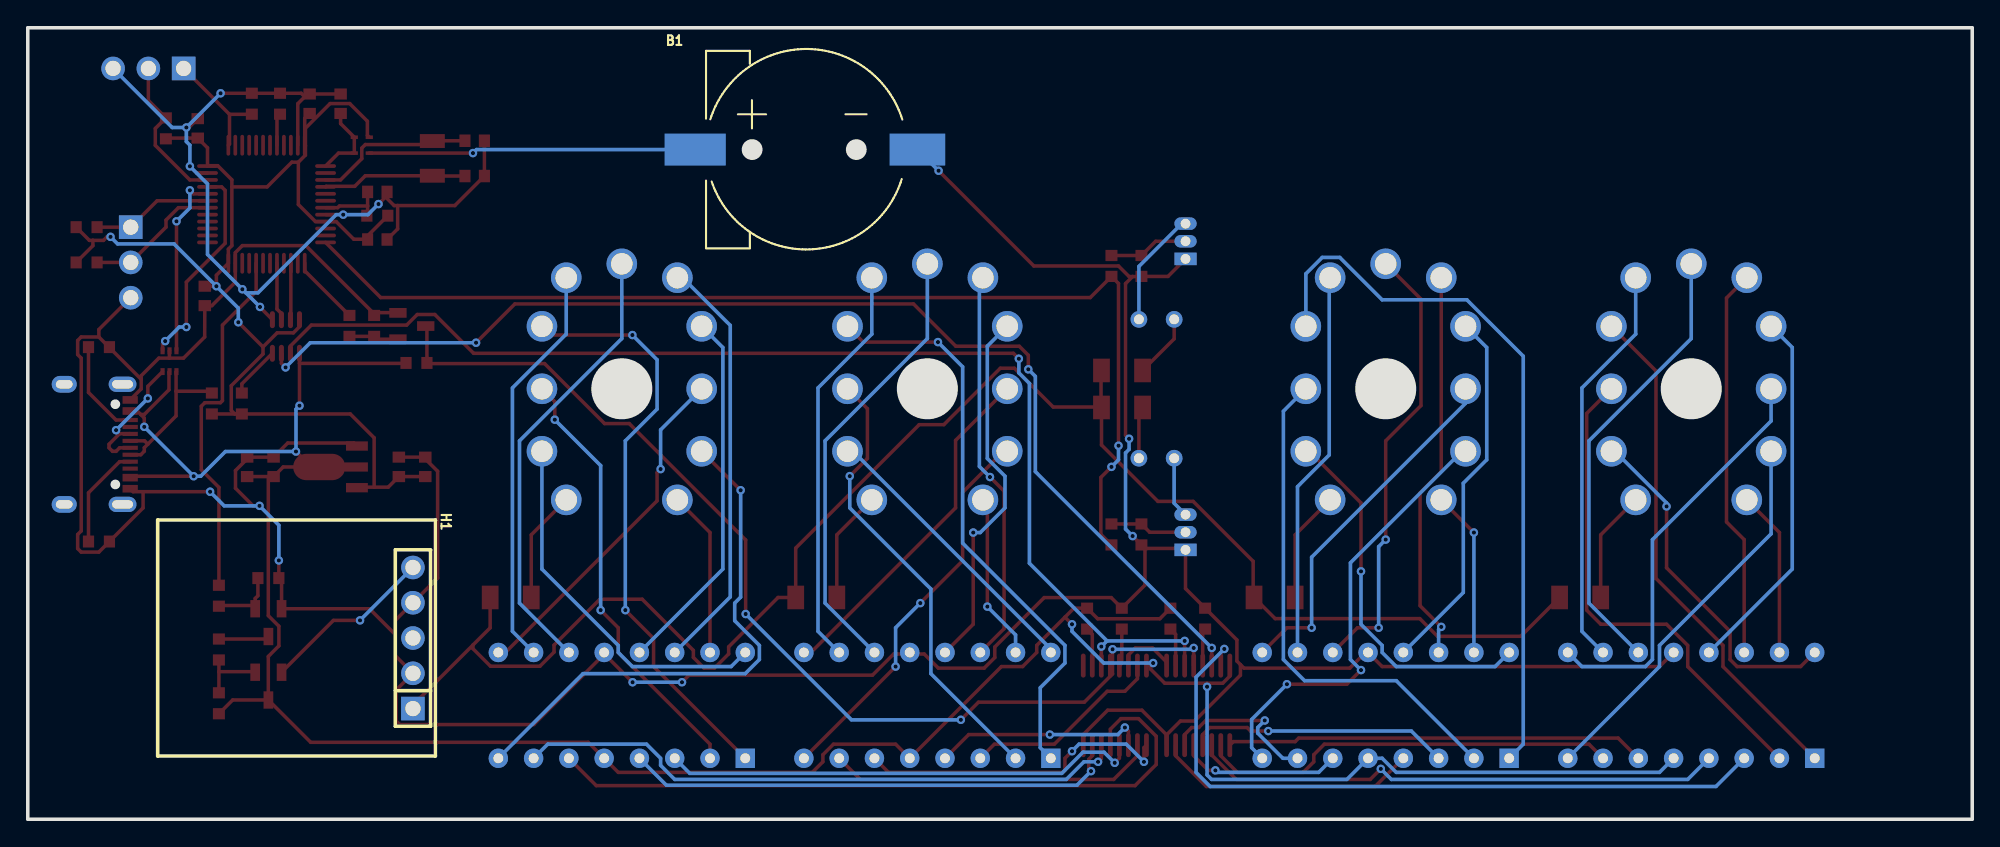
[diagram p3: board, bottom side, seen from below]

Outline 140 x 57 mm; copper layers: Top Layer, Bottom Layer. Coordinates in mm from the lower left corner of the outline.
Outline path: 0,57 140,57 140,0 0,0 0,57
Stack: Top Layer 0.035mm / Dielectric1 1.51mm FR4 er 4.5 / Bottom Layer 0.035mm

## Design rules (mm)
template: 自定义配置
spacing copperThickness1oz (default): track to track 0.102, other pairs 0.152 to 0.3
spacing copperThickness2oz: track to track 0.203, other pairs 0.152 to 0.3
track width copperThickness1oz (default): min 0.127, default 0.254, max 2.54
track width copperThickness2oz: min 0.203, default 0.254, max 2.54
differential pair differentialPair (default): width min 0.127, default 0.254, max 2.54; gap min 0.152, default 0.152
via viaSize (default): diameter min 0.5, default 0.61, max 10; hole min 0.3, default 0.305, max 6.3

## Placement (name value [footprint] x y rotation side)
B1  CR1220-2  [BAT-SMD_CR1220-2]  83.95 48.23 180 bottom
C1  12pF  [C0603]  107.82 48.86 180 top
C2  100nF  [C0603]  111.38 25.38 270 top
C3  4.7uF  [C0603]  113.28 25.38 270 top
C4  12pF  [C0603]  107.82 46.32 180 top
C5  100nF  [C0603]  117.47 51.53 270 top
C6  100nF  [C0603]  119.71 51.53 270 top
C7  100nF  [C0603]  124.21 25.38 270 top
C8  4.7uF  [C0603]  122.3 25.38 270 top
C9  100nF  [C0603]  114.83 45.18 0 top
C10  100nF  [C0603]  114.83 41.75 0 top
C11  100nF  [C0603]  127.76 49.75 270 top
C12  100nF  [C0603]  127.25 37.69 90 top
D1  USBLC6-2P6  [SOT-666-6_L1.6-W1.2-P0.50-LS1.6-BL]  129.79 32.99 180 top
D2  LRB520CS-30T5G  [SOD-923_L0.8-W0.6-LS1.0-RD]  115.95 49.12 180 top
D3  LRB520CS-30T5G  [SOD-923_L0.8-W0.6-LS1.0-RD]  115.95 47.97 180 top
DISP1  -  [QS27-1]  20.23 31 0 top
DISP2  -  [QS27-1]  42.23 31 0 top
DISP3  -  [QS27-1]  75.23 31 0 top
DISP4  -  [QS27-1]  97.23 31 0 top
H1  PZ254V-11-05P  [HDR-TH_5P-P2.54-V-M]  112.27 13.05 90 bottom
H2  PZ254V-11-03P  [HDR-TH_3P-P2.54-V-M]  131.32 54.07 0 top
H3  PZ254V-11-03P  [HDR-TH_3P-P2.54-V-M]  132.59 40.1 270 top
NE1  -  [NE]  58.73 36 0 top
NE2  -  [NE]  58.73 26 180 top
Q1  SS8050(RANGE:200-350)  [SOT-23-3_L2.9-W1.3-P1.90-LS2.4-BR]  112.35 35.52 0 top
Q2  MPSA42  [TO-92-3_L4.9-W3.7-P1.27-L]  56.64 41.62 90 top
Q3  MPSA42  [TO-92-3_L4.9-W3.7-P1.27-L]  56.64 20.67 90 top
Q4  SS8550 Y2(RANGE:200-350)  [SOT-23-3_L2.9-W1.3-P1.90-LS2.4-BR]  122.68 9.59 90 top
Q5  SS8050(RANGE:200-350)  [SOT-23-3_L2.9-W1.3-P1.90-LS2.4-BR]  122.68 14.16 90 top
R1  5.1kΩ  [R0603]  134.87 34 180 top
R2  1.5kΩ  [R0603]  126.75 29.94 90 top
R3  5.1kΩ  [R0603]  134.87 20 180 top
R4  10kΩ  [R0603]  124.59 29.94 270 top
R5  10kΩ  [R0603]  114.83 43.47 180 top
R6  10kΩ  [R0603]  121.84 51.53 270 top
R7  10kΩ  [R0603]  112.01 32.86 0 top
R8  2kΩ  [R0603]  116.84 35.53 270 top
R9  10kΩ  [R0603]  115.06 35.53 270 top
R10  10kΩ  [R0603]  126.24 8.35 270 top
R11  2kΩ  [R0603]  126.24 12.22 270 top
R12  2kΩ  [R0603]  126.24 16.1 90 top
R13  10kΩ  [R0603]  122.68 17.37 0 top
R14  10kΩ  [R0603]  130.06 49.75 270 top
R15  10kΩ  [R0603]  135.76 40.1 0 top
R16  10kΩ  [R0603]  135.76 42.64 0 top
R17  10kΩ  [R0603]  123.87 51.53 270 top
R22  10kΩ  [R0603]  55.23 14.45 270 top
R23  10kΩ  [R0603]  61.23 14.45 270 top
R24  10kΩ  [R0603]  57.73 14.45 270 top
R25  10kΩ  [R0603]  63.73 14.45 270 top
R26  20kΩ  [R1206]  28.23 15.97 180 top
R27  20kΩ  [R1206]  50.23 15.97 180 top
R28  20kΩ  [R1206]  83.23 15.97 180 top
R29  20kΩ  [R1206]  105.23 15.97 180 top
R30  200kΩ  [R1206]  61.21 32.32 0 top
R31  200kΩ  [R1206]  61.21 29.65 0 top
R32  10kΩ  [R0603]  59.82 39.85 270 top
R33  10kΩ  [R0603]  59.82 20.51 270 top
R48  2kΩ  [R0603]  61.98 20.51 90 top
R49  2kΩ  [R0603]  61.98 39.85 90 top
U1  RS0102YH8  [SOT-23-8_L3.0-W1.7-P0.65-LS2.8-BL]  121.41 34.77 0 top
U2  ME6211A33PG-N  [SOT-89_L4.5-W2.5-P1.50-LS4.2-BR]  117.66 25.38 180 top
U3  STM32F103C8T6  [LQFP-48_L7.0-W7.0-P0.50-LS9.0-BL]  122.81 44.29 270 top
U7  K155ID1/SN74141  [DIP16]  20.23 8.2 0 top
U8  K155ID1/SN74141  [DIP16]  42.23 8.2 0 top
U9  K155ID1/SN74141  [DIP16]  75.23 8.2 0 top
U10  K155ID1/SN74141  [DIP16]  97.23 8.2 0 top
U13  74HC595PW,118  [TSSOP-16_L5.0-W4.4-P0.65-LS6.4-BL]  55.73 8.2 0 top
U14  74HC595PW,118  [TSSOP-16_L5.0-W4.4-P0.65-LS6.4-BL]  61.73 8.2 0 top
USB1  TYPE-C 16PIN 2MD(073)  [USB-C-SMD_TYPE-C-6PIN-2MD-073]  135 27 90 top
X1  32.768kHz  [FC-135R_L3.2-W1.5]  110.87 47.59 90 top

## Footprints (pads in the part's own frame, mm; a bottom-side part is the same pattern mirrored in y, then rotated)
BAT-SMD_CR1220-2
  rect 4.4x2.3 smd: 1(-8,0)
  rect 4x2.3 smd: 2(8,0)
C0603
  rect 0.8x0.9 smd: 1(-0.7,0) 2(0.7,0)
DIP16
  rect 1.397x1.397 hole 0.711: 1(-8.89,-3.81)
  round 1.397 hole 0.711: 2(-6.35,-3.81) 3(-3.81,-3.81) 4(-1.27,-3.81) 5(1.27,-3.81) 6(3.81,-3.81) 7(6.35,-3.81) 8(8.89,-3.81) 9(8.89,3.81) 10(6.35,3.81) 11(3.81,3.81) 12(1.27,3.81) 13(-1.27,3.81) 14(-3.81,3.81) 15(-6.35,3.81) 16(-8.89,3.81)
FC-135R_L3.2-W1.5
  rect 1x1.8 smd: 1(-1.25,0) 2(1.25,0)
HDR-TH_3P-P2.54-V-M
  rect 1.7x1.7 hole 1.1: 1(-2.54,0)
  round 1.7 hole 1.1: 2(0,0) 3(2.54,0)
HDR-TH_5P-P2.54-V-M
  rect 1.7x1.7 hole 1.1: 1(-5.08,0)
  round 1.7 hole 1.1: 2(-2.54,0) 3(0,0) 4(2.54,0) 5(5.08,0)
LQFP-48_L7.0-W7.0-P0.50-LS9.0-BL
  oval 0.27x1.5 smd: 1(-2.75,-4.25) 2(-2.25,-4.25) 3(-1.75,-4.25) 4(-1.25,-4.25) 5(-0.75,-4.25) 6(-0.25,-4.25) 7(0.25,-4.25) 8(0.75,-4.25) 9(1.25,-4.25) 10(1.75,-4.25) 11(2.25,-4.25) 12(2.75,-4.25) 25(2.75,4.25) 26(2.25,4.25) 27(1.75,4.25) 28(1.25,4.25) 29(0.75,4.25) 30(0.25,4.25) 31(-0.25,4.25) 32(-0.75,4.25) 33(-1.25,4.25) 34(-1.75,4.25) 35(-2.25,4.25) 36(-2.75,4.25)
  oval 1.5x0.27 smd: 13(4.25,-2.75) 14(4.25,-2.25) 15(4.25,-1.75) 16(4.25,-1.25) 17(4.25,-0.75) 18(4.25,-0.25) 19(4.25,0.25) 20(4.25,0.75) 21(4.25,1.25) 22(4.25,1.75) 23(4.25,2.25) 24(4.25,2.75) 37(-4.25,2.75) 38(-4.25,2.25) 39(-4.25,1.75) 40(-4.25,1.25) 41(-4.25,0.75) 42(-4.25,0.25) 43(-4.25,-0.25) 44(-4.25,-0.75) 45(-4.25,-1.25) 46(-4.25,-1.75) 47(-4.25,-2.25) 48(-4.25,-2.75)
NE
  round 1.2 hole 0.711: 1(-1.27,0) 2(1.27,0)
QS27-1
  round 2.2 hole 1.55: 1(4,-8) 2(5.75,-4.5) 3(5.75,0) 4(5.75,4.5) 5(4,8) 6(0.001,9) 7(-3.999,8) 8(-5.75,4.5) 9(-5.75,0) 10(-5.75,-4.5) 11(-3.999,-8)
R0603
  rect 0.806x0.864 smd: 1(-0.753,0) 2(0.753,0)
R1206
  rect 1.208x1.701 smd: 1(-1.479,0) 2(1.479,0)
SOD-923_L0.8-W0.6-LS1.0-RD
  rect 0.52x0.26 smd: 1(-0.54,0) 2(0.54,0)
SOT-23-3_L2.9-W1.3-P1.90-LS2.4-BR
  rect 1.25x0.7 smd: 1(1,-0.95) 2(1,0.95) 3(-1,0)
SOT-23-8_L3.0-W1.7-P0.65-LS2.8-BL
  oval 0.364x1.222 smd: 1(-0.975,-1.211) 2(-0.325,-1.211) 3(0.325,-1.211) 4(0.975,-1.211) 5(0.975,1.211) 6(0.325,1.211) 7(-0.325,1.211) 8(-0.975,1.211)
SOT-89_L4.5-W2.5-P1.50-LS4.2-BR
  rect 1.575x0.672 smd: 1(1.356,-1.5) 3(1.356,1.5)
  custom 5.377x1.9 smd: 2(-1.356,0.009)
SOT-666-6_L1.6-W1.2-P0.50-LS1.6-BL
  rect 0.3x0.5 smd: 1(-0.5,-0.75) 2(0,-0.75) 3(0.5,-0.75) 4(0.5,0.75) 5(0,0.75) 6(-0.5,0.75)
TO-92-3_L4.9-W3.7-P1.27-L
  rect 0.9x1.6 hole 0.7: 1(-1.27,0)
  oval 0.9x1.6 hole 0.7: 2(0,0) 3(1.27,0)
TSSOP-16_L5.0-W4.4-P0.65-LS6.4-BL
  oval 0.343x1.732 smd: 1(-2.275,-2.866) 2(-1.625,-2.866) 3(-0.975,-2.866) 4(-0.325,-2.866) 5(0.325,-2.866) 6(0.975,-2.866) 7(1.625,-2.866) 8(2.275,-2.866) 9(2.275,2.866) 10(1.625,2.866) 11(0.975,2.866) 12(0.325,2.866) 13(-0.325,2.866) 14(-0.975,2.866) 15(-1.625,2.866) 16(-2.275,2.866)
USB-C-SMD_TYPE-C-6PIN-2MD-073
  rect 0.55x1.1 smd: 1(-3.2,2.375) 2(-2.4,2.375) 11(2.4,2.375) 12(3.2,2.375)
  rect 0.3x1.1 smd: 3(-1.75,2.375) 4(-1.25,2.375) 5(-0.75,2.375) 6(-0.25,2.375) 7(0.25,2.375) 8(0.75,2.375) 9(1.25,2.375) 10(1.75,2.375)
  oval 1.1x2 hole 0.6x1.5: 13(-4.325,1.825) 14(4.325,1.825)
  oval 1.2x1.8 hole 0.6x1.2: 13(-4.325,-2.375) 14(4.325,-2.375)

## Nets
As in the schematic.

Pads without a net: H1 3; U3 2 5 6 10 11 14 16 18 19 21 22 25 26 27 28 29 38 39 40 41 42 43 45 46; U14 9; USB1 3 9 13 14

## Via types
v1: diameter 0.61, hole 0.305, Top Layer to Bottom Layer, 80 vias

## Routing (per net, layer and track width the routed paths; a pad name or vN(x,y) marks a point on that pad's centre or on a via; arc(x,y) is an arc through that point)
3.3V: length 95.5
  Top Layer w0.254: 125.31,45.54 125.31,41.31 125.56,41.06 U3.24 126.42,39.18 v1(126.42,38.39) C12.2 ; 125.31,45.54 125.31,46.05 126.32,47.06 127.03,47.06 U3.36 127.06,48.35 127.76,49.06 130,49.06 R14.2 ; 125.31,45.54 122.76,45.54 120.99,47.32 120.52,47.32 ; 125.09,29.19 125.35,29.44 125.35,31.22 123.06,33.5 123.06,34.01 ; 125.09,29.19 R4.2 116.78,29.19 115.06,27.47 115.06,23.92 ; 125.09,29.19 R2.1 ; U1.8 120.44,35.47 120.88,35.03 122.05,35.03 123.06,34.01 ; v1(134.04,41.94) 134.3,41.94 134.55,41.69 135.31,41.69 ; 120.52,47.32 120.01,47.83 120.01,48.49 ; 120.52,47.32 120.52,44.27 119.29,43.04 U3.9 117.8,43.04 116.53,41.77 115.55,41.77 C10.2 115.53,42.01 114.08,43.47 ; 120.01,48.49 120.01,49.76 118.23,51.54 116.82,51.54 115.55,50.27 115.55,49.25 D2.2 ; 120.01,48.49 U3.48 120.06,50.48 C6.2 ; 135.31,41.69 135.57,41.69 R16.2 ; 135.31,41.69 135.31,41.31 R15.2 ; 115.06,23.92 114.05,23.92 C3.2 C2.2 ; 115.06,23.92 116.26,23.92 U2.3 ; 123.06,34.01 v1(124.84,35.79)
  Bottom Layer w0.254: v1(134.04,41.94) 133.53,41.44 129.47,41.44 v1(126.42,38.39) 124.84,36.81 v1(124.84,35.79)
+5V: length 197.8
  Top Layer w0.254: D1.5 129.84,32.2 129.84,30.93 131.61,29.15 131.87,29.15 ; USB1.11 132.12,29.4 131.87,29.15 ; 53.46,11.07 53.46,10.3 53.96,9.8 55.09,9.8 ; 55.09,9.8 v1(55.09,9.54) ; 55.09,9.8 58.14,9.8 59.16,10.81 59.16,11.07 ; 122.68,8.59 122.68,11.72 121.92,12.48 121.92,13.9 122.68,14.66 122.68,24.68 ; 122.68,24.68 C8.2 121.61,25.37 120.34,25.37 ; 122.68,24.68 C7.2 ; v1(128.06,24.7) 132.52,24.7 USB1.2 ; 120.44,32.83 U1.1 ; 120.44,32.83 112.8,32.83 R7.2 ; 120.44,32.83 v1(120.44,29.78) ; R24.1 58.49,14.44 62.97,14.44 R25.1 64.67,15.2 65.32,14.55 ; v1(58.97,11.25) 59.16,11.07 ; 59.16,11.07 59.46,11.07 ; 65.32,14.55 67.36,12.52 67.36,12.01 68.37,10.99 69.9,10.99 U9.5 77.52,5.41 81.99,5.41 82.75,4.64 82.75,4.14 83.51,3.37 97.48,3.37 U10.5 99.65,5.54 119.63,5.54 Q4.3 125.25,8.59 R10.2 ; 65.32,14.55 v1(64.82,14.04) ; 131.87,29.15 131.61,28.89 v1(131.61,28.26) ; 120.34,25.37 120.34,26.13 v1(120.69,26.48) ; 120.34,25.37 U2.2
  Bottom Layer w0.254: v1(58.97,11.25) 62.53,11.25 64.82,13.53 v1(64.82,14.04) ; v1(55.09,9.54) 55.09,3.19 54.77,2.87 45.02,2.87 U8.5 42.48,4.39 41.47,3.37 22.52,3.37 U7.5 ; v1(120.44,29.78) 120.69,29.53 v1(120.69,26.48) 125.77,26.48 127.55,24.7 v1(128.06,24.7) v1(131.61,28.26)
GND: length 367.8
  Top Layer w0.254: 124.08,26.08 C8.1 121.28,27.09 116.52,27.09 U2.1 ; 124.08,26.08 125.05,25.11 125.05,23.84 123.78,22.57 v1(123.32,22.57) ; 124.08,26.08 C7.1 ; 60.45,39.08 60.71,39.08 61.47,39.85 67.56,39.85 v1(74.42,46.7) ; 60.45,39.08 60.96,38.58 60.96,27.65 v1(60.71,27.4) ; 60.45,39.08 59.83,39.08 R32.2 57.9,39.09 Q2.1 ; 111.51,26.08 110.49,25.06 110.49,17.37 H1.4 113.54,14.32 113.54,13.3 ; 111.51,26.08 113.28,26.08 ; 111.51,26.08 C2.1 ; U7.12 22.52,10.99 42.48,10.99 U8.12 43.69,12.01 44.82,10.88 52.44,10.88 52.69,11.14 ; U3.47 120.56,51.53 120.06,52.03 ; 129.8,33.21 130.56,33.21 131.83,31.94 131.83,31.68 ; 129.8,33.21 129.8,33.73 D1.2 ; 129.8,33.21 128.79,33.21 127.26,34.73 C12.1 126.75,36.99 125.06,38.67 ; 113.37,44.19 109.25,44.19 C4.2 C1.2 ; 113.37,44.19 113.37,42.51 C10.1 ; 113.37,44.19 113.62,44.19 114.24,44.81 ; 59.56,19.5 R33.2 v1(60.45,20.39) ; 59.56,19.5 56.75,19.5 Q3.1 56.64,16.61 R22.1 52.94,12.91 52.94,11.39 52.69,11.14 ; 59.56,19.5 59.56,16.87 R23.1 61.99,15.96 66.82,15.96 70.37,12.41 70.37,11.64 71.14,10.88 74.44,10.88 75.45,11.9 76.39,11.9 ; 125.06,38.67 U3.23 125.06,40.8 124.55,41.31 119.98,41.31 115.15,36.48 ; 125.06,38.67 v1(124.55,38.17) ; 131.83,31.68 131.83,30.99 USB1.12 ; 131.83,31.68 134.88,34.73 ; 52.69,11.14 52.69,10.37 55.99,7.07 57.01,7.07 58,6.07 ; C5.1 C6.1 119.91,52.03 120.06,52.03 ; H3.3 134.88,35.27 134.88,34.73 ; C9.1 114.24,45.07 114.24,44.81 ; v1(128.58,49.82) 128.4,49.82 C11.1 ; 120.06,52.03 120.31,52.28 R6.1 R17.1 v1(126.12,52.28) ; U3.35 127.85,46.54 v1(128.33,47.02) ; 131.7,23.59 131.7,22.42 R3.2 134.88,19.24 136.15,19.24 136.41,19.49 136.41,20.51 136.15,20.76 136.15,33.21 136.41,33.46 136.41,34.48 136.15,34.73 134.88,34.73 ; 131.7,23.59 v1(126.87,23.59) ; 131.7,23.59 132.41,23.59 USB1.1 ; v1(121.92,18.64) R13.1 121.73,17.17 Q5.2 115.39,15.16 113.54,13.3 ; 115.15,36.48 115.15,36.37 R9.1 ; 115.15,36.48 113.36,36.48 Q1.2 ; 114.24,44.81 v1(114.75,44.3) ; U1.5 123.28,36.87 v1(123.28,36.9) ; 58,6.07 U13.8 ; 58,6.07 59.78,7.85 62.25,7.85 64,6.1 U14.8 ; 98.49,11.9 103.57,6.82 113.22,6.82 113.47,7.07 113.47,9.31 H1.2 113.54,11.78 113.54,13.3 ; 98.49,11.9 v1(96.45,9.87) ; 98.49,11.9 U10.12 ; 76.39,11.9 77.66,11.9 79.18,10.37 92.39,10.37 v1(92.9,9.87) ; 76.39,11.9 U9.12 ; v1(117.29,43.54) U3.8
  Bottom Layer w0.254: v1(60.45,20.39) 60.96,20.9 60.96,26.38 60.71,26.64 v1(60.71,27.4) ; 124.3,37.91 v1(123.28,36.9) ; 124.3,37.91 123.43,37.91 117.8,43.54 v1(117.29,43.54) 115.51,43.54 v1(114.75,44.3) ; 124.3,37.91 v1(124.55,38.17) 127.06,40.67 127.06,45.75 v1(128.33,47.02) 128.33,48.55 128.58,48.8 v1(128.58,49.82) ; B1.2 v1(74.42,46.7) ; v1(92.9,9.87) v1(96.45,9.87) ; v1(128.58,49.82) v1(126.12,52.28) ; v1(128.58,49.82) 129.61,49.82 H2.3 ; v1(126.87,23.59) 125.86,22.57 v1(123.32,22.57) 121.92,21.18 v1(121.92,18.64)
1_0: length 25.4
  Top Layer w0.254: v1(22.01,22.53) 22.01,18.11 17.44,13.53 17.44,11.5 16.93,10.99 12.36,10.99 U7.16
  Bottom Layer w0.254: DISP1.2 25.73,26.5 22.01,22.78 v1(22.01,22.53)
1_1: length 12
  Top Layer w0.254: DISP1.11 13.88,20.65 U7.15
1_2: length 28.2
  Bottom Layer w0.254: U7.8 22.52,10.99 22.52,12.52 14.48,20.55 DISP1.10
1_3: length 29.8
  Bottom Layer w0.254: DISP1.9 14.48,28.68 23.02,20.14 23.02,11.5 23.53,10.99 28.1,10.99 U7.9
1_4: length 26.6
  Bottom Layer w0.254: U7.13 12.96,18.01 12.96,33.98 DISP1.8
1_5: length 28.1
  Top Layer w0.254: U7.14 16.42,20.14 17.69,21.41 17.69,37.54 DISP1.7
1_6: length 32.5
  Bottom Layer w0.254: U7.11 27.6,15.57 27.6,27.25 20.23,34.62 DISP1.6
1_7: length 29.2
  Bottom Layer w0.254: U7.10 28.1,13.53 28.1,31.06 24.23,34.93 DISP1.5
1_8: length 37.2
  Top Layer w0.254: DISP1.4 22.77,32.29 22.77,17.34 17.94,12.52 17.94,10.99 U7.1
1_9: length 35.9
  Top Layer w0.254: U7.2 20.48,10.99 20.48,12.52 22.01,14.04 26.74,14.04 27.76,15.06 27.76,29.22 DISP1.3
1A: length 51.8
  Top Layer w0.254: U13.15 54.1,12.01 v1(53.85,12.26)
  Bottom Layer w0.254: v1(53.85,12.26) 55.88,10.23 55.88,3.37 54.87,2.36 18.45,2.36 U7.3
1B: length 30.2
  Top Layer w0.254: 53.46,5.33 53.2,5.59 48.75,5.59 48.5,5.84 25.49,5.84 U7.6
1C: length 30.3
  Top Layer w0.254: U7.7 27.6,5.41 46.65,5.41 47.41,4.64 47.41,4.14 48.17,3.37 52.91,3.37 54.1,4.57 U13.2
1D: length 38.5
  Top Layer w0.254: U13.3 54.75,4.62 53,2.87 43.34,2.87 v1(42.58,3.63)
  Bottom Layer w0.254: v1(42.58,3.63) 41.82,2.87 20.48,2.87 U7.4
2_0: length 26.9
  Top Layer w0.254: v1(44.01,17.85) 44.01,22.78 47.73,26.5 DISP2.2
  Bottom Layer w0.254: v1(44.01,17.85) 44.01,14.04 42.48,12.52 42.48,12.01 41.47,10.99 34.36,10.99 U8.16
2_1: length 12
  Top Layer w0.254: 35.88,20.65 DISP2.11
  Bottom Layer w0.254: U8.15 v1(35.88,20.65)
2_2: length 32.1
  Top Layer w0.254: v1(49.34,9.72) 45.02,9.72 v1(44.01,10.74)
  Bottom Layer w0.254: v1(44.01,10.74) 44.77,11.5 44.77,18.46 36.73,26.5 DISP2.10 ; v1(49.34,9.72) 51.88,7.18 51.88,5.15 U8.8
2_3: length 26.1
  Top Layer w0.254: v1(47.56,13.79) 49.34,13.79 U8.9
  Bottom Layer w0.254: v1(47.56,13.79) 47.56,18.87 36.48,29.95 DISP2.9
2_4: length 26.6
  Bottom Layer w0.254: U8.13 36.64,16.33 36.64,24.2 34.96,25.89 34.96,33.98 DISP2.8
2_5: length 28.3
  Top Layer w0.254: v1(38.23,13.85) 39.75,15.38 39.75,23.5 38.23,25.03 DISP2.7
  Bottom Layer w0.254: v1(38.23,13.85) 38.42,13.66 U8.14
2_6: length 32.6
  Top Layer w0.254: U8.11 44.26,13.79 v1(42.74,13.79) ; DISP2.6 39.69,37.46 39.69,29.79 42.23,27.25 v1(42.23,20.14)
  Bottom Layer w0.254: v1(42.23,20.14) 42.74,19.63 v1(42.74,13.79)
2_7: length 28
  Bottom Layer w0.254: DISP2.5 46.29,38.94 46.29,26.23 48.58,23.95 U8.10
2_8: length 52.2
  Bottom Layer w0.254: DISP2.4 47.98,39.28 46.8,40.46 45.53,40.46 42.48,37.41 36.39,37.41 32.32,33.35 32.32,5.41 U8.1
2_9: length 36.8
  Bottom Layer w0.254: DISP2.3 49.6,29.38 49.6,11.5 48.07,9.98 41.47,9.98 U8.2
2A: length 18.9
  Top Layer w0.254: v1(50.68,6.35) 51.95,6.35 52.21,6.6 54.9,6.6 55.41,6.1 U13.4
  Bottom Layer w0.254: U8.3 40.38,6.35 v1(50.68,6.35)
2B: length 11.7
  Top Layer w0.254: v1(54.49,3.52) 55,3.52 56.02,4.53 56.02,5.3 56.06,5.33
  Bottom Layer w0.254: U8.6 47.06,3.37 54.35,3.37 v1(54.49,3.52)
2C: length 11.7
  Top Layer w0.254: U13.6 56.71,6.1 56.2,6.6 55.69,6.6 55.18,7.11 v1(50.94,7.11)
  Bottom Layer w0.254: U8.7 49.63,4.39 51.45,6.2 51.45,6.6 v1(50.94,7.11)
2D: length 18.9
  Top Layer w0.254: U8.4 42.99,2.36 55.14,2.36 57.35,4.57 U13.7
3_0: length 20.8
  Bottom Layer w0.254: DISP3.2 80.97,26.49 80.56,26.49 66.34,12.26 U9.16
3_1: length 12
  Top Layer w0.254: DISP3.11 70.91,22.68 v1(70.91,15.31)
  Bottom Layer w0.254: U9.15 68.88,13.28 v1(70.91,15.31)
3_2: length 28.3
  Top Layer w0.254: DISP3.10 69.73,26.5 72.69,23.54 72.69,18.61 v1(75.74,15.57) ; U9.8 v1(77.52,10.99)
  Bottom Layer w0.254: v1(77.52,10.99) 77.52,13.79 v1(75.74,15.57)
3_3: length 25.4
  Top Layer w0.254: DISP3.9 73.2,27.28 73.2,22.42 83.61,12.01 U9.9
3_4: length 26.7
  Top Layer w0.254: U9.13 71.93,14.04 v1(71.93,20.65)
  Bottom Layer w0.254: DISP3.8 70.91,34.07 70.91,25.98 69.64,24.71 69.64,22.42 71.42,20.65 v1(71.93,20.65)
3_5: length 28.5
  Top Layer w0.254: U9.14 69.71,13.72 69.71,23.63 v1(70.72,24.65)
  Bottom Layer w0.254: DISP3.7 71.48,38.75 71.48,25.41 v1(70.72,24.65)
3_6: length 32.5
  Bottom Layer w0.254: DISP3.6 75.23,34.62 82.6,27.25 82.6,15.57 U9.11
3_7: length 29.2
  Bottom Layer w0.254: U9.10 83.1,13.53 83.1,31.06 79.23,34.93 DISP3.5
3_8: length 41.8
  Top Layer w0.254: v1(74.47,34.36) 79.84,34.36 DISP3.4
  Bottom Layer w0.254: v1(74.47,34.36) 72.69,32.58 72.69,19.88 65.32,12.52 65.32,11.25 67.1,9.47 67.1,5.15 U9.1
3_9: length 32.7
  Top Layer w0.254: DISP3.3 79.55,29.57 79.55,25.98 v1(80.82,24.71)
  Bottom Layer w0.254: U9.2 74.98,10.49 74.98,16.58 80.82,22.42 v1(80.82,24.71)
3A: length 14.6
  Top Layer w0.254: U9.3 70.4,5.41 66.09,5.41 62.28,9.22 61.01,9.22 60.1,10.12 U14.15
3B: length 23
  Top Layer w0.254: 59.46,5.33 59.64,5.15 v1(59.64,4.14) ; U9.6 78.02,3.37 65.47,3.37 65.32,3.52 65.32,4.39 v1(64.82,4.9)
  Bottom Layer w0.254: v1(59.64,4.14) 60.91,5.41 64.31,5.41 v1(64.82,4.9)
3C: length 23.6
  Top Layer w0.254: U14.2 60.1,4.57 61.81,2.87 80.06,2.87 U9.7
3D: length 15.2
  Top Layer w0.254: U14.3 60.75,6.35 v1(61.01,6.6) ; v1(66.41,6.1) 72.25,6.1 U9.4
  Bottom Layer w0.254: v1(66.41,6.1) 61.52,6.1 v1(61.01,6.6)
4_0: length 26.8
  Bottom Layer w0.254: DISP4.2 102.98,18.01 97.48,12.52 97.48,12.01 96.47,10.99 89.36,10.99 U10.16
4_1: length 12
  Top Layer w0.254: DISP4.11 90.88,20.65 U10.15
4_2: length 38.8
  Top Layer w0.254: v1(88.67,23.69) DISP4.10
  Bottom Layer w0.254: v1(88.67,23.69) 88.67,15.99 89.1,15.57 89.1,14.3 87.32,12.52 87.32,11.5 88.34,10.49 100.02,10.49 U10.8
4_3: length 25.4
  Top Layer w0.254: U10.9 105.61,12.01 94.69,22.93 94.69,24.96 v1(94.44,25.22)
  Bottom Layer w0.254: v1(94.44,25.22) 94.44,28.04 DISP4.9
4_4: length 26.6
  Bottom Layer w0.254: U10.13 89.96,18.01 89.96,33.98 DISP4.8
4_5: length 30.4
  Bottom Layer w0.254: U10.14 89.42,16.01 89.42,35.57 92.85,39 DISP4.7
4_6: length 32.5
  Bottom Layer w0.254: DISP4.6 97.23,34.62 104.6,27.25 104.6,15.57 U10.11
4_7: length 29.2
  Bottom Layer w0.254: U10.10 105.1,13.53 105.1,31.06 101.23,34.93 DISP4.5
4_8: length 42.5
  Top Layer w0.254: v1(96.98,15.06) 94.94,13.03 94.94,10.99 U10.1 ; DISP4.4 102.35,34.87 v1(96.47,34.87)
  Bottom Layer w0.254: v1(96.98,15.06) 96.98,27.25 94.69,29.54 94.69,33.09 v1(96.47,34.87)
4_9: length 31.6
  Top Layer w0.254: U10.2 90.88,5.41 97.48,12.01 97.48,13.79 v1(98.75,15.06) ; DISP4.3 102.06,30.08 v1(102.06,28.77)
  Bottom Layer w0.254: v1(98.75,15.06) 98.75,25.47 v1(102.06,28.77)
4A: length 34.5
  Top Layer w0.254: v1(61.74,4.06) 61.41,4.4 U14.4
  Bottom Layer w0.254: U10.3 92.33,3.3 65.55,3.3 64.03,4.83 62.5,4.83 v1(61.74,4.06)
4B: length 51.1
  Top Layer w0.254: U10.6 99.07,2.42 60.28,2.42 58.75,3.94 58.75,5.97 60.02,7.24 61.29,7.24 62.06,6.48 62.06,5.33
4C: length 44.2
  Top Layer w0.254: v1(62.94,4.14) 62.71,4.37 U14.6
  Bottom Layer w0.254: v1(62.94,4.14) 63.96,4.14 65.23,2.87 93.42,2.87 94.44,3.88 94.44,4.39 95.45,5.41 102.56,5.41 U10.7
4D: length 35.8
  Top Layer w0.254: U14.7 63.35,4.57 63.61,4.32 63.61,3.62 v1(63.45,3.46)
  Bottom Layer w0.254: U10.4 94.02,2.45 64.46,2.45 v1(63.45,3.46)
D+: length 15.1
  Top Layer w0.254: U3.33 126.04,45.54 125.79,45.29 125.79,41.48 128.58,38.68 v1(128.58,35.45) ; v1(130.11,34.43) 130.29,34.25 D1.1
  Bottom Layer w0.254: v1(128.58,35.45) 129.09,35.45 v1(130.11,34.43)
D-: length 13.3
  Top Layer w0.254: v1(129.29,43.06) D1.3 ; U3.32 128.07,45.04 v1(128.33,45.3)
  Bottom Layer w0.254: v1(129.29,43.06) 128.33,44.03 v1(128.33,45.3)
DM: length 11.8
  Top Layer w0.254: USB1.5 131.86,26.25 131.61,26.5 131.61,26.76 131.36,27.01 ; 129.32,30.82 126.87,30.82 R2.2 ; 129.32,30.82 129.32,32.21 D1.4 ; 129.32,30.82 129.32,29.04 131.36,27.01 ; USB1.7 131.59,27.25 131.36,27.01
DOT_CTRL: length 79.2
  Top Layer w0.254: v1(61.98,25.38) 62.74,24.61 62.74,20.52 R48.1 ; v1(61.47,26.9) 61.47,38.58 R49.1 63.5,37.57 114.59,37.57 U3.12
  Bottom Layer w0.254: v1(61.98,25.38) 61.47,25.88 v1(61.47,26.9)
DP: length 9.8
  Top Layer w0.254: D1.6 131.36,31.18 v1(131.36,30.31) ; USB1.8 132.64,27.77 133.39,27.77 ; 133.39,27.77 134.15,27 134.15,26.75 133.9,26.5 133.64,26.5 133.39,26.75 USB1.6 ; 133.39,27.77 v1(133.64,28.02)
  Bottom Layer w0.254: v1(133.64,28.02) v1(131.36,30.31)
HV: length 120.2
  Top Layer w0.254: R29.1 106.71,13.78 107.95,12.54 ; R30.2 62.72,32.29 62.72,29.69 ; 62.72,29.69 66.17,29.69 68.96,32.48 69.98,32.48 74.04,28.42 75.82,28.42 84.71,19.53 R28.1 85.98,15.97 89.54,12.41 89.54,11.91 90.55,10.89 91.31,10.89 92.08,11.65 92.08,12.16 95.76,15.84 98.81,15.84 102.11,12.54 102.11,12.03 103.12,11.02 106.68,11.02 107.95,12.29 107.95,12.54 ; 62.72,29.69 R31.2 62.69,26.95 58.63,22.89 56.09,22.89 51.77,18.57 51.77,16.03 R27.1 50.19,14.45 39.77,14.45 38.5,13.18 32.5,13.18 R26.1 ; 107.95,12.54 112.27,8.22 H1.1
HV_ENABLE: length 26
  Top Layer w0.254: U3.20 123.56,38.01 125.98,35.58 125.98,30.14 126.13,30 127.25,30 127.51,29.74 127.51,25.17 126.24,23.9 R12.2
MCU_STCP: length 5.1
  Top Layer w0.254: R8.1 120.06,39.5 U3.13
SPI1_MOSI: length 4.2
  Top Layer w0.254: U3.17 122.06,36.74 121.74,36.42 U1.6
SPI1_SCK: length 4.1
  Top Layer w0.254: U1.7 121.06,36.01 U3.15
SPI_CLK: length 87.5
  Top Layer w0.254: U1.2 121.09,34.08 119.58,35.59 112.72,35.59 111.96,36.35 110.69,36.35 107.9,33.56 69.03,33.56 v1(68.64,33.16) ; v1(62.71,12.43) U14.11 ; U13.11 v1(56.71,12.84)
  Bottom Layer w0.254: v1(56.71,12.84) 62.29,12.84 ; 62.29,12.84 v1(62.71,12.43) ; 62.29,12.84 67.88,18.43 67.88,31.39 68.64,32.15 v1(68.64,33.16)
SPI_MOSI: length 85.9
  Top Layer w0.254: U1.3 121.74,32.84 v1(121.44,32.54) ; v1(107.72,34.32) 104.93,37.11 76.23,37.11 73.18,34.06 68.61,34.06 67.96,33.42 v1(67.96,32.4) ; U13.14 v1(54.75,12.34)
  Bottom Layer w0.254: v1(54.75,12.34) 67.46,25.04 67.46,31.89 v1(67.96,32.4) ; v1(121.44,32.54) 119.66,34.32 v1(107.72,34.32)
STCP: length 76.3
  Top Layer w0.254: 61.9,11.22 62.06,11.07 ; 61.9,11.22 v1(61.9,12.24) ; 61.9,11.22 61.9,10.46 63.93,8.43 71.55,8.43 v1(72.82,7.16) ; 56.06,11.07 v1(56.06,12.34) ; Q1.3 111.26,35.43 R7.1 111.21,32.81 102.79,32.81 98.47,28.5 96.69,28.5 88.31,20.11 v1(88.31,14.78)
  Bottom Layer w0.254: v1(88.31,14.78) 80.69,7.16 v1(72.82,7.16) ; v1(56.06,12.34) 56.15,12.24 v1(61.9,12.24)
SWCLK: length 8.5
  Top Layer w0.254: 125.48,50.77 123.88,50.77 R17.2 ; 125.48,50.77 125.48,48.62 U3.37 ; 125.48,50.77 H2.1
SWDIO: length 11.2
  Top Layer w0.254: H2.2 131.32,51.77 R14.1 130.82,49.75 130.82,48.53 128.33,46.04 U3.34
UART1_RX: length 8.7
  Top Layer w0.254: R16.1 H3.1 130.69,44.54 U3.31
UART1_TX: length 9.9
  Top Layer w0.254: R15.1 H3.2 130.05,42.64 130.05,43.15 129.16,44.04 U3.30
$1N3910: length 11.7
  Top Layer w0.254: C1.1 110.85,48.86 X1.2 111.12,48.59 115.7,48.59 115.95,48.33 115.95,47.57 117.48,46.04 U3.3
$1N3961: length 10.4
  Top Layer w0.254: U3.4 118.52,45.58 116.46,45.58 115.7,46.34 X1.1 110.85,46.32 C4.1
$1N4256: length 5.7
  Top Layer w0.254: C5.2 117.47,50.1 D2.1 D3.1 117.63,47.97 U3.1
$1N4428: length 4.8
  Top Layer w0.254: C9.2 115.53,44.16 ; 115.53,44.16 115.53,43.52 R5.1 ; 115.53,44.16 117.56,44.16 117.69,44.04 U3.7
$1N5489: length 7.1
  Top Layer w0.254: R1.1 135.63,30.74 133.64,28.75 USB1.10
$1N5494: length 7.4
  Top Layer w0.254: USB1.4 133.39,25.75 135.63,23.51 R3.1
$1N5575: length 2.3
  Top Layer w0.254: R6.2 122.06,50.56 U3.44
$1N9036: length 12.6
  Top Layer w0.254: Q4.2 117.99,14.32 v1(116.08,14.32)
  Bottom Layer w0.254: H1.5 v1(116.08,14.32)
$1N14895: length 23.6
  Top Layer w0.254: v1(107.95,47.97) D3.2
  Bottom Layer w0.254: B1.1 107.69,48.23 v1(107.95,47.97)
$1N27037: length 3.8
  Top Layer w0.254: R4.1 124.59,31.36 U1.4
$1N27425: length 3.6
  Top Layer w0.254: Q1.1 114.86,34.57 R9.2 R8.2
$1N29272: length 5
  Top Layer w0.254: 123.63,10.59 123.67,10.63 126.24,10.63 ; 126.24,10.63 R11.2 ; 126.24,10.63 R10.1
$1N29379: length 4.9
  Top Layer w0.254: R13.2 123.43,16.1 123.63,15.9 123.63,15.39 ; 123.63,15.39 123.63,15.16 ; 123.63,15.39 126.19,15.39 R12.1
$1N29410: length 3.6
  Top Layer w0.254: Q5.3 122.86,12.98 R11.1
$2N1006: length 4.4
  Top Layer w0.254: U13.9 58,11.32 59.02,12.34 60.25,12.34 60.75,11.83 U14.14
$2N1078: length 2.7
  Top Layer w0.254: U13.13 55.41,13.52 R22.2
$2N1080: length 2.7
  Top Layer w0.254: U14.13 61.23,11.24 R23.2
$2N1103: length 2.8
  Top Layer w0.254: U13.10 57.35,13.32 R24.2
$2N1107: length 2.8
  Top Layer w0.254: R25.2 63.35,13.32 U14.10
$2N2676: length 8.1
  Top Layer w0.254: DISP1.1 26.75,20.48 R26.2
$2N2765: length 8.1
  Top Layer w0.254: 48.75,15.97 48.75,20.48 DISP2.1
$2N2853: length 8.1
  Top Layer w0.254: DISP3.1 81.75,20.48 81.75,15.97
$2N2941: length 8.1
  Top Layer w0.254: DISP4.1 103.75,20.48 103.75,15.97
$2N5464: length 8.4
  Bottom Layer w0.254: NE1.2 60,39.81 56.92,42.89 Q2.3
$2N5488: length 4.6
  Top Layer w0.254: 59.74,32.32 57.46,34.6 NE1.1
$2N5622: length 4.4
  Bottom Layer w0.254: Q3.3 57.46,22.76 NE2.2
$2N5624: length 3.8
  Top Layer w0.254: NE2.1 60,29.39 59.74,29.65
$2N5723: length 5.6
  Top Layer w0.254: Q3.2 59.22,20.67 R33.1 R48.2
$2N5739: length 5.8
  Top Layer w0.254: R49.2 R32.1 58.79,41.62 Q2.2
